# Altium project PCB_Project1.PrjPCB (part 1 of 2)
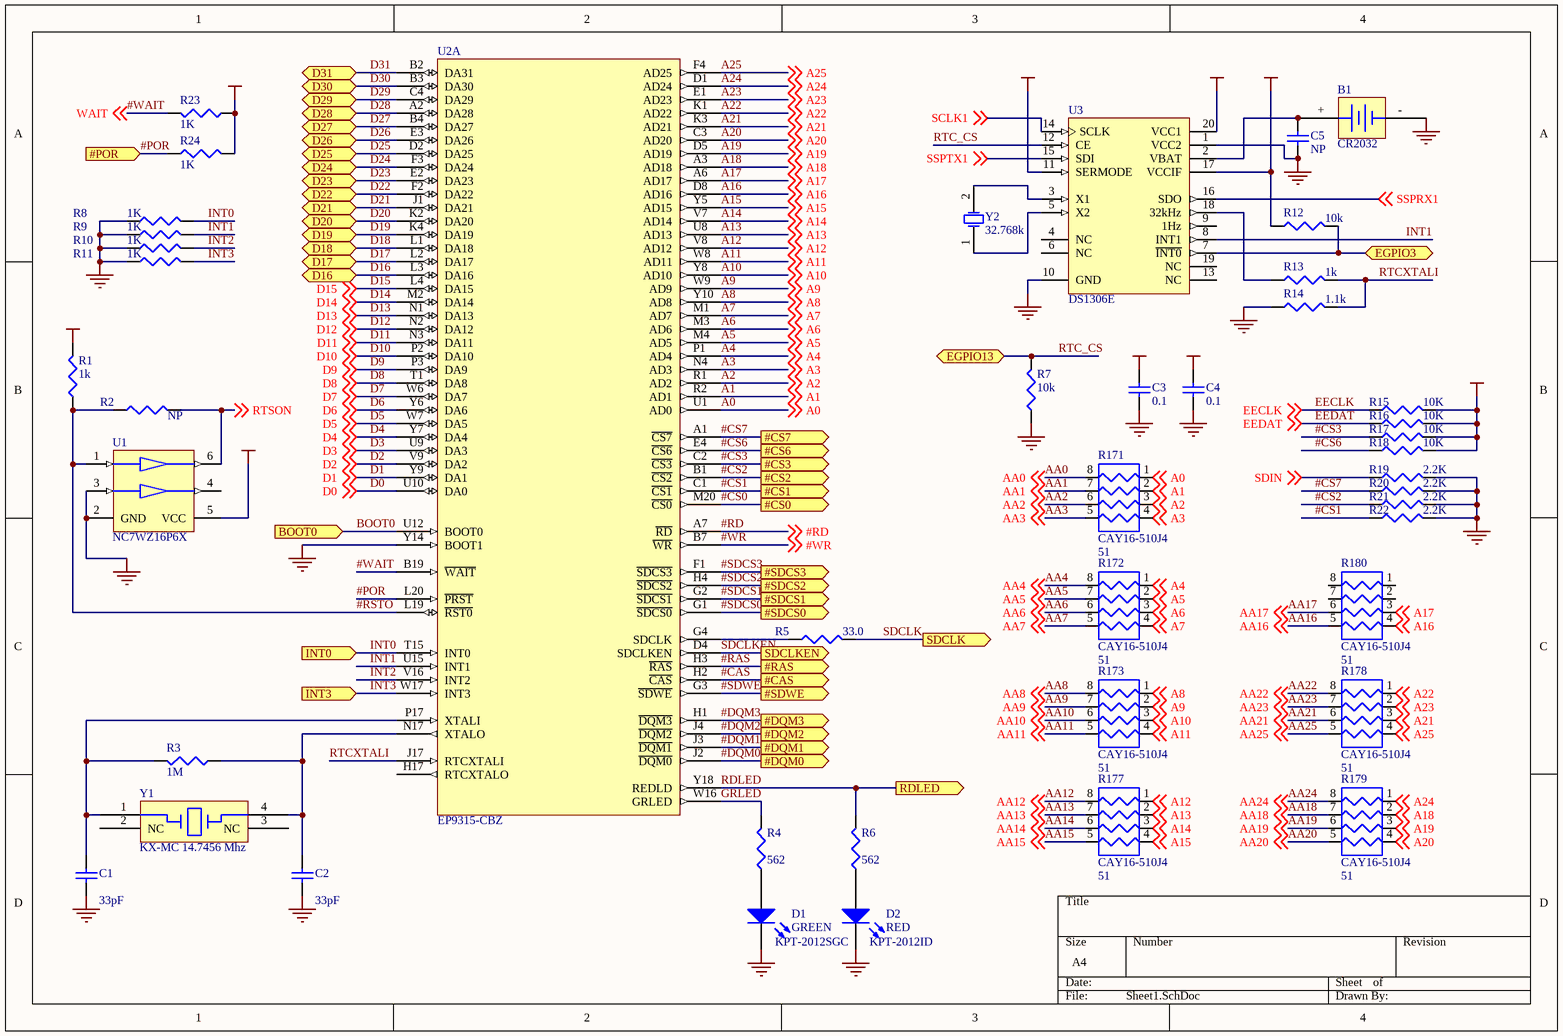
[diagram p0: Sheet1.SchDoc]
11 sheets, 503 parts. Net scope: flat (ports and power ports of the same name join across sheets).
Board file: PCB1.PcbDoc
Sheets:
  Sheet1.SchDoc
  Sheet2.SchDoc
  Sheet3.SchDoc
  Sheet4.SchDoc
  Sheet5.SchDoc
  Sheet6.SchDoc
  Sheet7.SchDoc
  Sheet8.SchDoc
  Sheet9.SchDoc
  Sheet10.SchDoc
  Sheet11.SchDoc

## Sheet Sheet1.SchDoc: RTC
size A4; SheetNumber: 1; SheetTotal: 9

### Parts
B1  CR2032  [CR2032]
C1  33pF  [0603]
C2  33pF  [0603]
C3  0.1  [0603]
C4  0.1  [0603]
C5  NP  [0603]
D1  GREEN  value KPT-2012SGC  [DSO-F2/D6.1]
D2  RED  value KPT-2012ID  [DSO-F2/D6.1]
R1  1k  [CR1608-0603]
R2  NP  [CR1608-0603]
R3  1M  [CR1608-0603]
R4  562  [CR1608-0603]
R5  value 33.0  [CR1608-0603]  (hidden comment: 33)
R6  562  [CR1608-0603]
R7  10k  [CR1608-0603]
R8  1k  [CR1608-0603]
R9  1k  [CR1608-0603]
R10  1k  [CR1608-0603]
R11  1k  [CR1608-0603]
R12  10k  [CR1608-0603]
R13  1k  [CR1608-0603]
R14  1.1k  [CR1608-0603]
R15  10k  [CR1608-0603]
R16  10k  [CR1608-0603]
R17  10k  [CR1608-0603]
R18  10k  [CR1608-0603]
R19  2.2k  [CR1608-0603]
R20  2.2k  [CR1608-0603]
R21  2.2k  [CR1608-0603]
R22  2.2k  [CR1608-0603]
R23  1k  [CR1608-0603]
R24  1k  [CR1608-0603]
R171  CAY16-510J4  value 51  [CAY16-J4]
R172  CAY16-510J4  value 51  [CAY16-J4]
R173  CAY16-510J4  value 51  [CAY16-J4]
R177  CAY16-510J4  value 51  [CAY16-J4]
R178  CAY16-510J4  value 51  [CAY16-J4]
R179  CAY16-510J4  value 51  [CAY16-J4]
R180  CAY16-510J4  value 51  [CAY16-J4]
U1  NC7WZ16P6X  [SC88]
U2  EP9315-CBZ  [BGA352x20]  (part A of 4)
U3  DS1306E  [TSSOP20]
Y1  KX-MC 14.7456 Mhz  [KX-MC]
Y2  32.768k  [BCY-W2/D3.1]

### Ports
#CAS (out), #CS0 (out), #CS1 (out), #CS2 (out), #CS3 (out), #CS6 (out), #CS7 (out), #DQM0 (out), #DQM1 (out), #DQM2 (out), #DQM3 (out), #POR (in), #RAS (out), #SDCS0 (out), #SDCS1 (out), #SDCS2 (out), #SDCS3 (out), #SDWE (out), BOOT0 (in), D16 (bidir), D17 (bidir), D18 (bidir), D19 (bidir), D20 (bidir), D21 (bidir), D22 (bidir), D23 (bidir), D24 (bidir), D25 (bidir), D26 (bidir), D27 (bidir), D28 (bidir), D29 (bidir), D30 (bidir), D31 (bidir), EGPIO3 (bidir), EGPIO13 (bidir), INT0 (in), INT3 (in), RDLED (out), SDCLK (out), SDCLKEN (out)

### Nets
GND: B1.- C1.1 C2.1 C3.1 C4.1 C5.1 D1.2(K) D2.2(K) R7.1 R8.1 R9.1 R10.1 R11.1 R14.1 R19.2 R20.2 R21.2 R22.2 U1.2(GND) U1.3(B) U2.Y14(BOOT1) U3.1(VCC2) U3.10(GND)
VCC5V0: C4.2 U3.20(VCC1)
VCCIO: C3.2 R1.2 R12.1 R15.2 R16.2 R17.2 R18.2 R23.1 R24.2 U1.5(VCC) U3.11(SERMODE) U3.17(VCCIF)
#CAS: U2.H2(~{CAS}) ; port #CAS
#CS0: U2.M20(~{CS0}) ; port #CS0
#CS1: R22.1 U2.C1(~{CS1}) ; port #CS1
#CS2: R21.1 U2.B1(~{CS2}) ; port #CS2
#CS3: R17.1 U2.C2(~{CS3}) ; port #CS3
#CS6: R18.1 U2.E4(~{CS6}) ; port #CS6
#CS7: R20.1 U2.A1(~{CS7}) ; port #CS7
#DQM0: U2.J2(~{DQM0}) ; port #DQM0
#DQM1: U2.J3(~{DQM1}) ; port #DQM1
#DQM2: U2.J4(~{DQM2}) ; port #DQM2
#DQM3: U2.H1(~{DQM3}) ; port #DQM3
#POR: R24.1 U2.L20(~{PRST}) ; port #POR
#RAS: U2.H3(~{RAS}) ; port #RAS
#RD: U2.A7(~{RD}) ; off-sheet #RD
#RSTO: R1.1 R2.1 U1.1(A) U2.L19(~{RST0})
#SDCS0: U2.G1(~{SDCS0}) ; port #SDCS0
#SDCS1: U2.G2(~{SDCS1}) ; port #SDCS1
#SDCS2: U2.H4(~{SDCS2}) ; port #SDCS2
#SDCS3: U2.F1(~{SDCS3}) ; port #SDCS3
#SDWE: U2.G3(~{SDWE}) ; port #SDWE
#WAIT: R23.2 U2.B19(~{WAIT}) ; off-sheet WAIT  [also labelled WAIT]
#WR: U2.B7(~{WR}) ; off-sheet #WR
A0: R171.1 U2.U1(AD0) ; off-sheet A0
A1: R171.2 U2.R2(AD1) ; off-sheet A1
A2: R171.3 U2.R1(AD2) ; off-sheet A2
A3: R171.4 U2.N4(AD3) ; off-sheet A3
A4: R172.1 U2.P1(AD4) ; off-sheet A4
A5: R172.2 U2.M4(AD5) ; off-sheet A5
A6: R172.3 U2.M3(AD6) ; off-sheet A6
A7: R172.4 U2.M1(AD7) ; off-sheet A7
A8: R173.1 U2.Y10(AD8) ; off-sheet A8
A9: R173.2 U2.W9(AD9) ; off-sheet A9
A10: R173.3 U2.Y8(AD10) ; off-sheet A10
A11: R173.4 U2.W8(AD11) ; off-sheet A11
A12: R177.1 U2.V8(AD12) ; off-sheet A12
A13: R177.2 U2.U8(AD13) ; off-sheet A13
A14: R177.3 U2.V7(AD14) ; off-sheet A14
A15: R177.4 U2.Y5(AD15) ; off-sheet A15
A16: R180.4 U2.D8(AD16) ; off-sheet A16
A17: R180.3 U2.A6(AD17) ; off-sheet A17
A18: R179.2 U2.A3(AD18) ; off-sheet A18
A19: R179.3 U2.D5(AD19) ; off-sheet A19
A20: R179.4 U2.C3(AD20) ; off-sheet A20
A21: R178.3 U2.K3(AD21) ; off-sheet A21
A22: R178.1 U2.K1(AD22) ; off-sheet A22
A23: R178.2 U2.E1(AD23) ; off-sheet A23
A24: R179.1 U2.D1(AD24) ; off-sheet A24
A25: R178.4 U2.F4(AD25) ; off-sheet A25
AA0: R171.8 ; off-sheet AA0
AA1: R171.7 ; off-sheet AA1
AA2: R171.6 ; off-sheet AA2
AA3: R171.5 ; off-sheet AA3
AA4: R172.8 ; off-sheet AA4
AA5: R172.7 ; off-sheet AA5
AA6: R172.6 ; off-sheet AA6
AA7: R172.5 ; off-sheet AA7
AA8: R173.8 ; off-sheet AA8
AA9: R173.7 ; off-sheet AA9
AA10: R173.6 ; off-sheet AA10
AA11: R173.5 ; off-sheet AA11
AA12: R177.8 ; off-sheet AA12
AA13: R177.7 ; off-sheet AA13
AA14: R177.6 ; off-sheet AA14
AA15: R177.5 ; off-sheet AA15
AA16: R180.5 ; off-sheet AA16
AA17: R180.6 ; off-sheet AA17
AA18: R179.7 ; off-sheet AA18
AA19: R179.6 ; off-sheet AA19
AA20: R179.5 ; off-sheet AA20
AA21: R178.6 ; off-sheet AA21
AA22: R178.8 ; off-sheet AA22
AA23: R178.7 ; off-sheet AA23
AA24: R179.8 ; off-sheet AA24
AA25: R178.5 ; off-sheet AA25
BOOT0: U2.U12(BOOT0) ; port BOOT0
D0: U2.U10(DA0) ; off-sheet D0
D1: U2.Y9(DA1) ; off-sheet D1
D2: U2.V9(DA2) ; off-sheet D2
D3: U2.U9(DA3) ; off-sheet D3
D4: U2.Y7(DA4) ; off-sheet D4
D5: U2.W7(DA5) ; off-sheet D5
D6: U2.Y6(DA6) ; off-sheet D6
D7: U2.W6(DA7) ; off-sheet D7
D8: U2.T1(DA8) ; off-sheet D8
D9: U2.P3(DA9) ; off-sheet D9
D10: U2.P2(DA10) ; off-sheet D10
D11: U2.N3(DA11) ; off-sheet D11
D12: U2.N2(DA12) ; off-sheet D12
D13: U2.N1(DA13) ; off-sheet D13
D14: U2.M2(DA14) ; off-sheet D14
D15: U2.L4(DA15) ; off-sheet D15
D16: U2.L3(DA16) ; port D16
D17: U2.L2(DA17) ; port D17
D18: U2.L1(DA18) ; port D18
D19: U2.K4(DA19) ; port D19
D20: U2.K2(DA20) ; port D20
D21: U2.J1(DA21) ; port D21
D22: U2.F2(DA22) ; port D22
D23: U2.E2(DA23) ; port D23
D24: U2.F3(DA24) ; port D24
D25: U2.D2(DA25) ; port D25
D26: U2.E3(DA26) ; port D26
D27: U2.B4(DA27) ; port D27
D28: U2.A2(DA28) ; port D28
D29: U2.C4(DA29) ; port D29
D30: U2.B3(DA30) ; port D30
D31: U2.B2(DA31) ; port D31
EECLK: R15.1 ; off-sheet EECLK
EEDAT: R16.1 ; off-sheet EEDAT
GRLED: R4.2 U2.W16(GRLED)
INT0: R8.2 U2.T15(INT0) ; port INT0
INT1: R9.2 U2.U15(INT1) U3.8(INT1)
INT2: R10.2 U2.V16(INT2)
INT3: R11.2 U2.W17(INT3) ; port INT3
RDLED: R6.2 U2.Y18(REDLD) ; port RDLED
RTC_CS: R7.2 U3.12(CE) ; port EGPIO13
RTCXTALI: R13.2 R14.2 U2.J17(RTCXTALI)
RTSON: R2.2 U1.6(Y) ; off-sheet RTSON
SCLK1: U3.14(SCLK) ; off-sheet SCLK1
SDCLK: R5.2 ; port SDCLK
SDCLKEN: U2.D4(SDCLKEN) ; port SDCLKEN
SDIN: R19.1 ; off-sheet SDIN
SSPRX1: U3.16(SDO) ; off-sheet SSPRX1  [project net SD_DO]
SSPTX1: U3.15(SDI) ; off-sheet SSPTX1  [project net SD_DI]
NetB1_+: B1.+ C5.2 U3.2(VBAT)
NetC1_2: C1.2 R3.2 U2.P17(XTALI) Y1.1
NetC2_2: C2.2 R3.1 U2.N17(XTALO) Y1.4
NetD1_1: D1.1(A) R4.1
NetD2_1: D2.1(A) R6.1
NetR5_1: R5.1 U2.G4(SDCLK)
NetR12_2: R12.2 U3.7(~{INT0}) ; port EGPIO3
NetR13_1: R13.1 U3.18(32kHz)
NetU3_3: U3.3(X1) Y2.2(OSC2)
NetU3_5: U3.5(X2) Y2.1(OSC1)

Not connected (* = marked no-connect by the designer): R180 1 2 7 8; U1 4(Y); U2 H17(RTCXTALO); U3 4(NC) 6(NC) 9(1Hz) 13(NC) 19(NC); Y1 2(NC) 3(NC)

### Library data of the parts
B1 = CR2032: CR2032 Battery holder
C1-C4 = C0603: Ceramic Chip Capacitor - Standard; Note: Footprint corresponds to dimensions for bulk cassette packaging. This case size has tightened tolerances.; Published: 17-Jul-2002; LatestRevisionDate: 19-Mar-2004; LatestRevisionNote: Silkscreen size reduced.; DatasheetDocument: Mar-2001; PackageDocument: Mar-2001; PackageReference: 0603; Publisher: Altium Limited; Code_JEITA: 0603; Code_IPC: 1608 [0603]; ComponentLink1Description: Manufacturer Link; ComponentLink1URL: http://www.kemet.com/; ComponentLink2Description: Datasheet; ComponentLink2URL: http://www.kemet.com/kemet/web/homepage/kechome.nsf/vapubfilesname/F3102TA.pdf/$file/F3102TA.pdf
  C1 C2: Value: 33pF
  C3 C4: Value: 0.1
C5 = C0603: Ceramic Chip Capacitor - Standard; Note: Footprint corresponds to dimensions for bulk cassette packaging. This case size has tightened tolerances.; Value: 0.1; Published: 17-Jul-2002; LatestRevisionDate: 19-Mar-2004; LatestRevisionNote: Silkscreen size reduced.; DatasheetDocument: Mar-2001; PackageDocument: Mar-2001; PackageReference: 0603; Publisher: Altium Limited; Code_JEITA: 0603; Code_IPC: 1608 [0603]; ComponentLink1Description: Manufacturer Link; ComponentLink1URL: http://www.kemet.com/; ComponentLink2Description: Datasheet; ComponentLink2URL: http://www.kemet.com/kemet/web/homepage/kechome.nsf/vapubfilesname/F3102TA.pdf/$file/F3102TA.pdf
D1 D2 = LED2: Typical RED, GREEN, YELLOW, AMBER GaAs LED; Published: 8-Jun-2000; Revision: July-2002: Re-released for DXP Platform.; Publisher: Altium Limited
R1-R24 = Res3: Resistor; Published: 8-Jun-2000; Revision: July-2002: Re-released for DXP Platform.; Publisher: Altium Limited
  R1 R13: Value: 1k
  R2: Value: NP
  R3: Value: 1M
  R4 R6: Value: 562
  R7 R12: Value: 10k
  R8-R11 R23 R24: Value: 1K
  R14: Value: 1.1k
  R15-R18: Value: 10K
  R19-R22: Value: 2.2K
R171-R173 R177-R180 = CAY16-J4: Chip Resistor Arrays
U1 = NC7WZ16P6X: TinyLogic UHS Dual Buffer
U2 = EP9315-CBZ: 32 Bit ARM920T Microcontroller with inegrated graphics, IDE, PCMCIA, Ethernet
U3 = DS1306E: Serial Alarm Real-Time Clock
Y1 = QRZ_KX_MC: QUARTZ CRYSTAL
Y2 = ECS-110-S-5P: Crystal Oscillator; Published: 17-Jul-2002; Datasheet: Latest Revision: 18-Apr-2000; Package Reference: CSM-7; Publisher: Altium Limited

## Sheet Sheet2.SchDoc
size A4
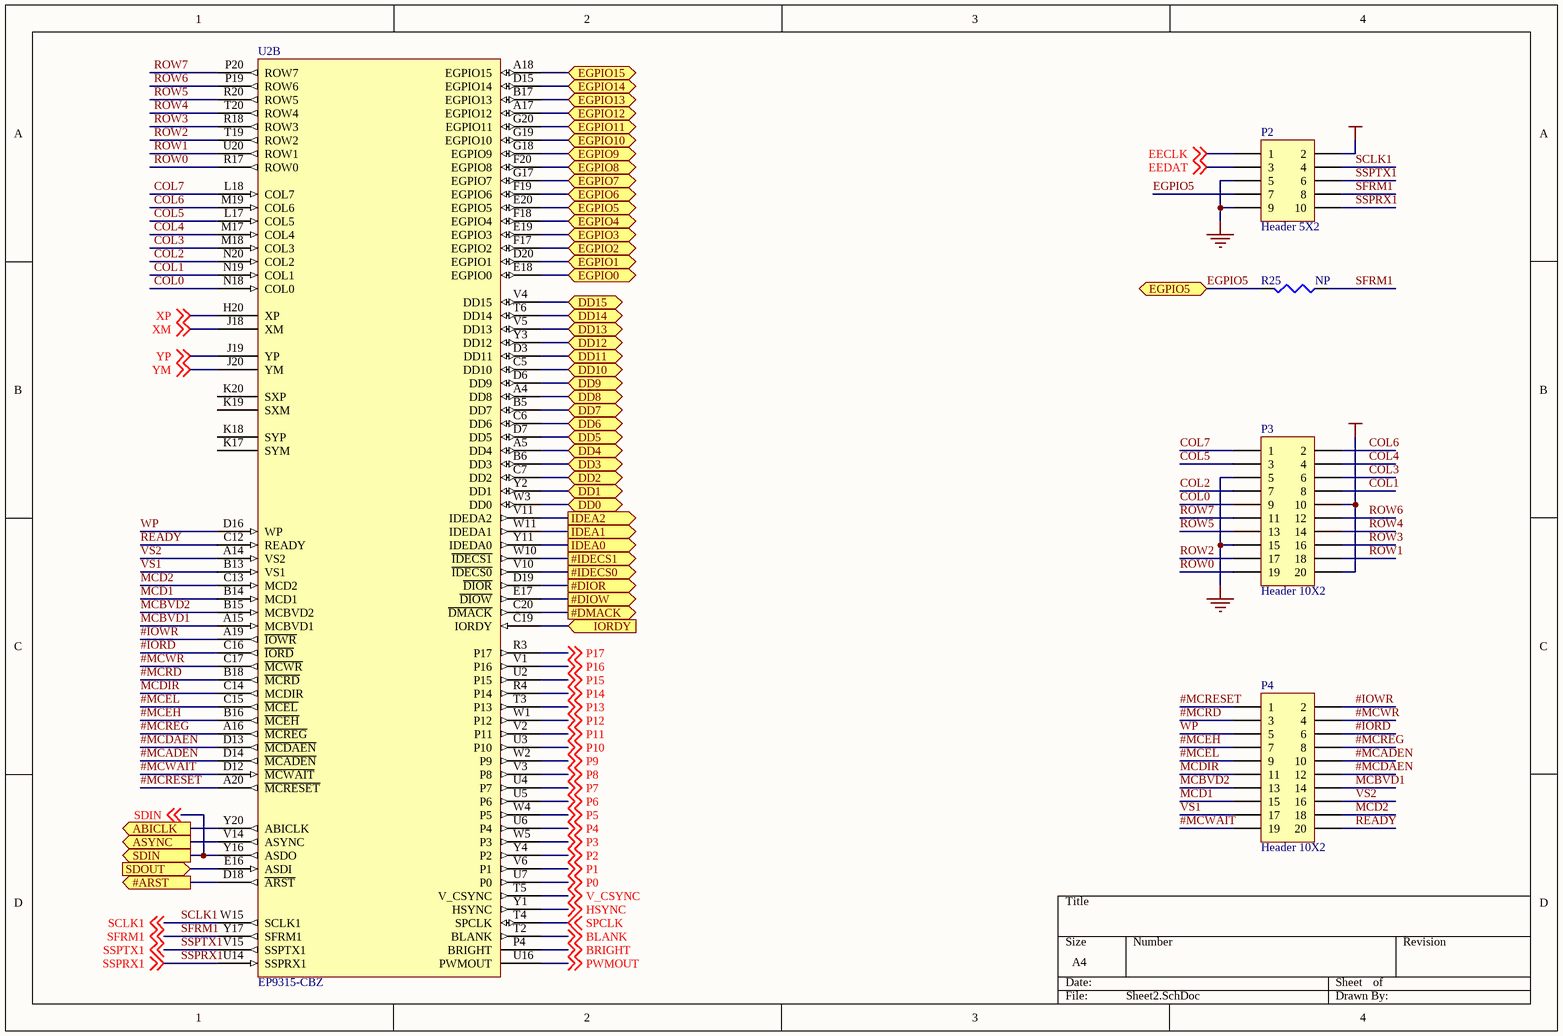
[diagram p1: Sheet2.SchDoc]

### Parts
P2  Header 5X2  [HDR2X5]
P3  Header 10X2  [HDR2X10]
P4  Header 10X2  [HDR2X10]
R25  NP  [CR1608-0603]
U2  EP9315-CBZ  [BGA352x20]  (part B of 4)

### Ports
#ARST (out), #DIOR (out), #DIOW (out), #DMACK (out), #IDECS0 (out), #IDECS1 (out), ABICLK (out), ASYNC (out), DD0 (bidir), DD1 (bidir), DD2 (bidir), DD3 (bidir), DD4 (bidir), DD5 (bidir), DD6 (bidir), DD7 (bidir), DD8 (bidir), DD9 (bidir), DD10 (bidir), DD11 (bidir), DD12 (bidir), DD13 (bidir), DD14 (bidir), DD15 (bidir), EGPIO0 (bidir), EGPIO1 (bidir), EGPIO2 (bidir), EGPIO3 (bidir), EGPIO4 (bidir), EGPIO5 (bidir), EGPIO6 (bidir), EGPIO7 (bidir), EGPIO8 (bidir), EGPIO9 (bidir), EGPIO10 (bidir), EGPIO11 (bidir), EGPIO12 (bidir), EGPIO13 (bidir), EGPIO14 (bidir), EGPIO15 (bidir), IDEA0 (out), IDEA1 (out), IDEA2 (out), IORDY (in), SDIN (out), SDOUT (in)

### Nets
GND: P2.5 P2.9 P3.5 P3.15
VCCIO: P2.2 P3.10 P3.20
#IORD: P4.6 U2.C16(~{IORD})
#IOWR: P4.2 U2.A19(~{IOWR})
#MCADEN: P4.10 U2.D14(~{MCADEN})
#MCDAEN: P4.12 U2.D13(~{MCDAEN})
#MCEH: P4.7 U2.B16(~{MCEH})
#MCEL: P4.9 U2.C15(~{MCEL})
#MCRD: P4.3 U2.B18(~{MCRD})
#MCREG: P4.8 U2.A16(~{MCREG})
#MCRESET: P4.1 U2.A20(~{MCRESET})
#MCWAIT: P4.19 U2.D12(~{MCWAIT})
#MCWR: P4.4 U2.C17(~{MCWR})
BLANK: U2.T2(BLANK) ; off-sheet BLANK
BRIGHT: U2.P4(BRIGHT) ; off-sheet BRIGHT
COL0: P3.9 U2.N18(COL0)
COL1: P3.8 U2.N19(COL1)
COL2: P3.7 U2.N20(COL2)
COL3: P3.6 U2.M18(COL3)
COL4: P3.4 U2.M17(COL4)
COL5: P3.3 U2.L17(COL5)
COL6: P3.2 U2.M19(COL6)
COL7: P3.1 U2.L18(COL7)
EECLK: P2.1 ; off-sheet EECLK
EEDAT: P2.3 ; off-sheet EEDAT
EGPIO0: U2.E18(EGPIO0) ; port EGPIO0
EGPIO5: P2.7 R25.2 U2.E20(EGPIO5) ; port EGPIO5
HSYNC: U2.Y1(HSYNC) ; off-sheet HSYNC
MCBVD1: P4.14 U2.A15(MCBVD1)
MCBVD2: P4.13 U2.B15(MCBVD2)
MCD1: P4.15 U2.B14(MCD1)
MCD2: P4.18 U2.C13(MCD2)
MCDIR: P4.11 U2.C14(MCDIR)
P0: U2.U7(P0) ; off-sheet P0
P1: U2.V6(P1) ; off-sheet P1
P2: U2.Y4(P2) ; off-sheet P2
P3: U2.W5(P3) ; off-sheet P3
P4: U2.U6(P4) ; off-sheet P4
P5: U2.W4(P5) ; off-sheet P5
P6: U2.U5(P6) ; off-sheet P6
P7: U2.U4(P7) ; off-sheet P7
P8: U2.V3(P8) ; off-sheet P8
P9: U2.W2(P9) ; off-sheet P9
P10: U2.U3(P10) ; off-sheet P10
P11: U2.V2(P11) ; off-sheet P11
P12: U2.W1(P12) ; off-sheet P12
P13: U2.T3(P13) ; off-sheet P13
P14: U2.R4(P14) ; off-sheet P14
P15: U2.U2(P15) ; off-sheet P15
P16: U2.V1(P16) ; off-sheet P16
P17: U2.R3(P17) ; off-sheet P17
PWMOUT: U2.U16(PWMOUT) ; off-sheet PWMOUT
READY: P4.20 U2.C12(READY)
ROW0: P3.19 U2.R17(ROW0)
ROW1: P3.18 U2.U20(ROW1)
ROW2: P3.17 U2.T19(ROW2)
ROW3: P3.16 U2.R18(ROW3)
ROW4: P3.14 U2.T20(ROW4)
ROW5: P3.13 U2.R20(ROW5)
ROW6: P3.12 U2.P19(ROW6)
ROW7: P3.11 U2.P20(ROW7)
RTC_CS: U2.B17(EGPIO13) ; port EGPIO13
~{SD_CS}: U2.F18(EGPIO4) ; port EGPIO4
SCLK1: P2.4 U2.W15(SCLK1) ; off-sheet SCLK1
SDIN: U2.Y16(ASDO) ; off-sheet SDIN, port SDIN
SFRM1: P2.8 R25.1 U2.Y17(SFRM1) ; off-sheet SFRM1
SPCLK: U2.T4(SPCLK) ; off-sheet SPCLK
SSPRX1: P2.10 U2.U14(SSPRX1) ; off-sheet SSPRX1  [project net SD_DO]
SSPTX1: P2.6 U2.V15(SSPTX1) ; off-sheet SSPTX1  [project net SD_DI]
V_CSYNC: U2.T5(V_CSYNC) ; off-sheet V_CSYNC
VS1: P4.17 U2.B13(VS1)
VS2: P4.16 U2.A14(VS2)
WP: P4.5 U2.D16(WP)
XM: U2.J18(XM) ; off-sheet XM
XP: U2.H20(XP) ; off-sheet XP
YM: U2.J20(YM) ; off-sheet YM
YP: U2.J19(YP) ; off-sheet YP
NetR12_2: U2.E19(EGPIO3) ; port EGPIO3
NetR28_2: U2.D20(EGPIO1) ; port EGPIO1
NetR66_1: U2.F17(EGPIO2) ; port EGPIO2
NetR67_1: U2.E17(~{DIOW}) ; port #DIOW
NetR68_1: U2.D19(~{DIOR}) ; port #DIOR
NetR69_1: U2.C19(IORDY) ; port IORDY
NetR70_1: U2.C20(~{DMACK}) ; port #DMACK
NetR72_1: U2.A18(EGPIO15) ; port EGPIO15
NetR74_1: U2.B5(DD7) ; port DD7
NetR74_2: U2.C6(DD6) ; port DD6
NetR74_3: U2.D7(DD5) ; port DD5
NetR74_4: U2.A5(DD4) ; port DD4
NetR75_1: U2.B6(DD3) ; port DD3
NetR75_2: U2.C7(DD2) ; port DD2
NetR75_3: U2.Y2(DD1) ; port DD1
NetR75_4: U2.W3(DD0) ; port DD0
NetR76_1: U2.W11(IDEDA1) ; port IDEA1
NetR76_2: U2.Y11(IDEDA0) ; port IDEA0
NetR76_3: U2.V10(~{IDECS0}) ; port #IDECS0
NetR88_5: U2.D3(DD11) ; port DD11
NetR88_6: U2.C5(DD10) ; port DD10
NetR88_7: U2.D6(DD9) ; port DD9
NetR88_8: U2.A4(DD8) ; port DD8
NetR89_5: U2.V4(DD15) ; port DD15
NetR89_6: U2.T6(DD14) ; port DD14
NetR89_7: U2.V5(DD13) ; port DD13
NetR89_8: U2.Y3(DD12) ; port DD12
NetR90_1: U2.V11(IDEDA2) ; port IDEA2
NetR90_2: U2.W10(~{IDECS1}) ; port #IDECS1
NetR91_2: U2.G18(EGPIO9) ; port EGPIO9
NetR92_2: U2.F20(EGPIO8) ; port EGPIO8
NetR102_2: U2.D15(EGPIO14) ; port EGPIO14
NetR103_2: U2.E16(ASDI) ; port SDOUT
NetR106_1: U2.F19(EGPIO6) ; port EGPIO6
NetR153_1: U2.G17(EGPIO7) ; port EGPIO7
NetR156_1: U2.A17(EGPIO12) ; port EGPIO12
NetU2_D18: U2.D18(~{ARST}) ; port #ARST
NetU2_G19: U2.G19(EGPIO10) ; port EGPIO10
NetU2_G20: U2.G20(EGPIO11) ; port EGPIO11
NetU2_V14: U2.V14(ASYNC) ; port ASYNC
NetU2_Y20: U2.Y20(ABICLK) ; port ABICLK

Not connected (* = marked no-connect by the designer): U2 K17(SYM) K18(SYP) K19(SXM) K20(SXP)

### Library data of the parts
P2 = Header 5X2: Header, 5-Pin, Dual row; LatestRevisionDate: 17-Jul-2002; LatestRevisionNote: Re-released for DXP Platform.; Publisher: Altium Limited
P3 P4 = Header 10X2: Header, 10-Pin, Dual row; LatestRevisionDate: 17-Jul-2002; LatestRevisionNote: Re-released for DXP Platform.; Publisher: Altium Limited
R25 = Res3: Resistor; Published: 8-Jun-2000; Revision: July-2002: Re-released for DXP Platform.; Publisher: Altium Limited; Value: NP
U2 = EP9315-CBZ: as U2 on sheet Sheet1

## Sheet Sheet3.SchDoc
size A4
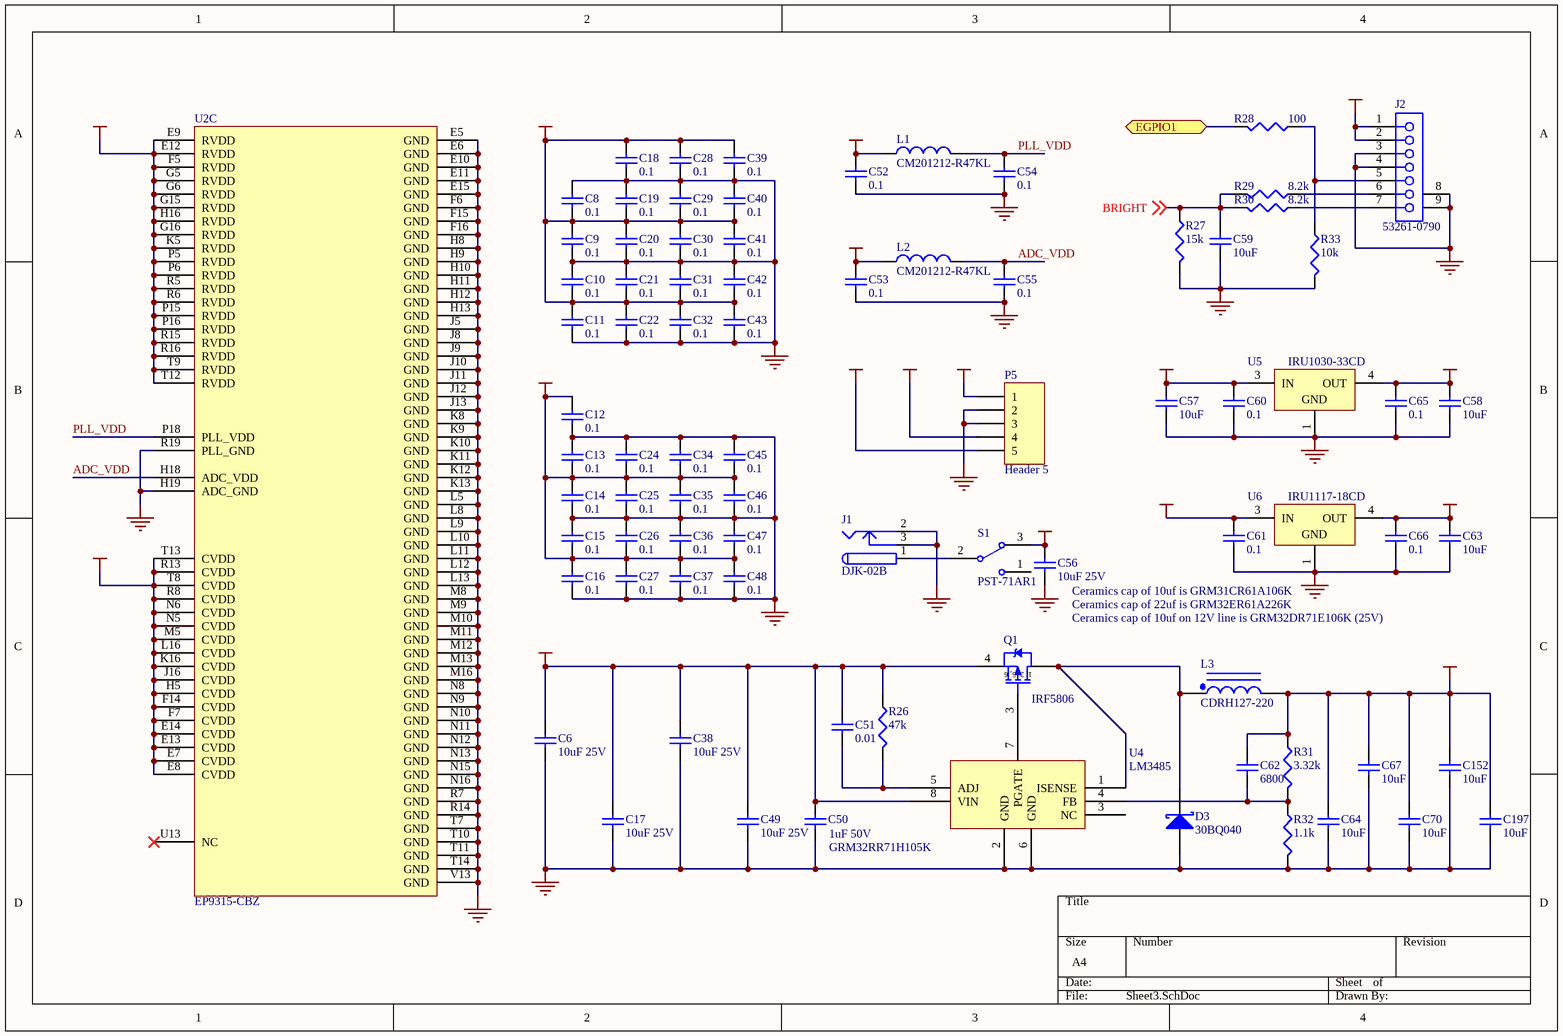
[diagram p2: Sheet3.SchDoc]

### Parts
C6  10uF 25V  [1210]
C8  0.1  [0603]
C9  0.1  [0603]
C10  0.1  [0603]
C11  0.1  [0603]
C12  0.1  [0603]
C13  0.1  [0603]
C14  0.1  [0603]
C15  0.1  [0603]
C16  0.1  [0603]
C17  10uF 25V  [1210]
C18  0.1  [0603]
C19  0.1  [0603]
C20  0.1  [0603]
C21  0.1  [0603]
C22  0.1  [0603]
C24  0.1  [0603]
C25  0.1  [0603]
C26  0.1  [0603]
C27  0.1  [0603]
C28  0.1  [0603]
C29  0.1  [0603]
C30  0.1  [0603]
C31  0.1  [0603]
C32  0.1  [0603]
C34  0.1  [0603]
C35  0.1  [0603]
C36  0.1  [0603]
C37  0.1  [0603]
C38  10uF 25V  [1210]
C39  0.1  [0603]
C40  0.1  [0603]
C41  0.1  [0603]
C42  0.1  [0603]
C43  0.1  [0603]
C45  0.1  [0603]
C46  0.1  [0603]
C47  0.1  [0603]
C48  0.1  [0603]
C49  10uF 25V  [1210]
C50  GRM32RR71H105K  value 1uF 50V  [1210]
C51  0.01  [0603]
C52  0.1  [0603]
C53  0.1  [0603]
C54  0.1  [0603]
C55  0.1  [0603]
C56  10uF 25V  [1210]
C57  10uF  [1206]
C58  10uF  [1206]
C59  10uF  [1206]
C60  0.1  [0603]
C61  0.1  [0603]
C62  6800  [0603]
C63  10uF  [1206]
C64  10uF  [1206]
C65  0.1  [0603]
C66  0.1  [0603]
C67  10uF  [1206]
C70  10uF  [1206]
C152  10uF  [1206]
C197  10uF  [1206]
D3  30BQ040  [DIODE SMC]
J1  DJK-02B  [DJK-02A]
J2  53261-0790  [53261-07]
L1  CM201212-R47KL  [INDC2012-0805]
L2  CM201212-R47KL  [INDC2012-0805]
L3  CDRH127-220  [CDRH127]
P5  Header 5  [HDR1X5]
Q1  IRF5806  [Micro6]
R26  47k  [CR1608-0603]
R27  15k  [CR1608-0603]
R28  value 100  [CR1608-0603]  (hidden comment: 0)
R29  value 8.2k  [CR1608-0603]  (hidden comment: 0)
R30  8.2k  [CR1608-0603]
R31  value 3.32k  [CR1608-0603]  (hidden comment: 3.6k)
R32  1.1k  [CR1608-0603]
R33  value 10k  [CR1608-0603]  (hidden comment: 0)
S1  PST-71AR1  [PST-71AR1]
U2  EP9315-CBZ  [BGA352x20]  (part C of 4)
U4  LM3485  [MSOP8]
U5  IRU1030-33CD  [TO-252-2 (D-PAK)]
U6  IRU1117-18CD  [TO-252-2 (D-PAK)]

### Ports
EGPIO1 (bidir)

### Nets
GND: C6.1 C8.2 C9.1 C10.2 C11.1 C12.1 C13.2 C14.1 C15.2 C16.1 C17.1 C18.1 C19.2 C20.1 C21.2 C22.1 C24.2 C25.1 C26.2 C27.1 C28.1 C29.2 C30.1 C31.2 C32.1 C34.2 C35.1 C36.2 C37.1 C38.1 C39.1 C40.2 C41.1 C42.2 C43.1 C45.2 C46.1 C47.2 C48.1 C49.1 C50.1 C52.1 C53.1 C54.1 C55.1 C56.1 C57.1 C58.1 C59.1 C60.1 C61.1 C63.1 C64.1 C65.1 C66.1 C67.1 C70.1 C152.1 C197.1 D3.1(A) J1.2 J1.3 J2.3 J2.4 J2.8 J2.9 P5.2 P5.3 R27.2 R32.2 R33.2 U2.E5(GND) U2.E6(GND) U2.E10(GND) U2.E11(GND) U2.E15(GND) U2.F6(GND) U2.F15(GND) U2.F16(GND) U2.H8(GND) U2.H9(GND) U2.H10(GND) U2.H11(GND) U2.H12(GND) U2.H13(GND) U2.H19(ADC_GND) U2.J5(GND) U2.J8(GND) U2.J9(GND) U2.J10(GND) U2.J11(GND) U2.J12(GND) U2.J13(GND) U2.K8(GND) U2.K9(GND) U2.K10(GND) U2.K11(GND) U2.K12(GND) U2.K13(GND) U2.L5(GND) U2.L8(GND) U2.L9(GND) U2.L10(GND) U2.L11(GND) U2.L12(GND) U2.L13(GND) U2.M8(GND) U2.M9(GND) U2.M10(GND) U2.M11(GND) U2.M12(GND) U2.M13(GND) U2.M16(GND) U2.N8(GND) U2.N9(GND) U2.N10(GND) U2.N11(GND) U2.N12(GND) U2.N13(GND) U2.N15(GND) U2.N16(GND) U2.R7(GND) U2.R14(GND) U2.R19(PLL_GND) U2.T7(GND) U2.T10(GND) U2.T11(GND) U2.T14(GND) U2.V13(GND) U4.2(GND) U4.6(GND) U5.1(GND) U6.1(GND)
VCC5V0: C57.2 C60.2 C62.2 C64.2 C67.2 C70.2 C152.2 C197.2 L3.2 P5.4 R31.1 U5.3(IN)
VCC12: C6.2 C17.2 C38.2 C49.2 C50.2 C51.2 C56.2 J2.1 J2.2 P5.1 Q1.4(S) R26.1 S1.3 U4.8(VIN)
VCCCORE: C12.2 C13.1 C14.2 C15.1 C16.2 C24.1 C25.2 C26.1 C27.2 C34.1 C35.2 C36.1 C37.2 C45.1 C46.2 C47.1 C48.2 C52.2 C63.2 C66.2 L1.1 U2.E7(CVDD) U2.E8(CVDD) U2.E13(CVDD) U2.E14(CVDD) U2.F7(CVDD) U2.F14(CVDD) U2.H5(CVDD) U2.J16(CVDD) U2.K16(CVDD) U2.L16(CVDD) U2.M5(CVDD) U2.N5(CVDD) U2.N6(CVDD) U2.R8(CVDD) U2.R13(CVDD) U2.T8(CVDD) U2.T13(CVDD) U6.4(OUT)
VCCIO: C8.1 C9.2 C10.1 C11.2 C18.2 C19.1 C20.2 C21.1 C22.2 C28.2 C29.1 C30.2 C31.1 C32.2 C39.2 C40.1 C41.2 C42.1 C43.2 C53.2 C58.2 C61.2 C65.2 L2.1 P5.5 U2.E9(RVDD) U2.E12(RVDD) U2.F5(RVDD) U2.G5(RVDD) U2.G6(RVDD) U2.G15(RVDD) U2.G16(RVDD) U2.H16(RVDD) U2.K5(RVDD) U2.P5(RVDD) U2.P6(RVDD) U2.P15(RVDD) U2.P16(RVDD) U2.R5(RVDD) U2.R6(RVDD) U2.R15(RVDD) U2.R16(RVDD) U2.T9(RVDD) U2.T12(RVDD) U5.4(OUT) U6.3(IN)
ADC_VDD: C55.2 L2.2 U2.H18(ADC_VDD)
BRIGHT: C59.2 R27.1 R29.2 R30.2 ; off-sheet BRIGHT
PLL_VDD: C54.2 L1.2 U2.P18(PLL_VDD)
NetC51_1: C51.1 R26.2 U4.5(ADJ)
NetC62_1: C62.1 R31.2 R32.1 U4.4(FB)
NetD3_2: D3.2(K) L3.1 Q1.1(D) Q1.2(D) Q1.5(D) Q1.6(D) U4.1(ISENSE)
NetJ1_1: J1.1 S1.2
NetJ2_5: J2.5 R28.1 R33.1
NetJ2_6: J2.6 R29.1
NetJ2_7: J2.7 R30.1
NetQ1_3: Q1.3(G) U4.7(PGATE)
NetR28_2: R28.2 ; port EGPIO1

Not connected (* = marked no-connect by the designer): S1 1; U2 U13(NC)*; U4 3(NC)

### Notes on the sheet
- Ceramics cap of 10uf is GRM31CR61A106K
- Ceramics cap of 10uf on 12V line is GRM32DR71E106K (25V)
- Ceramics cap of 22uf is GRM32ER61A226K
- (in symbol IRF5806) 1, 2, 5, 6

### Library data of the parts
C6 C17 C38 C49 C50 C56 = C1210: Ceramic Chip Capacitor - Standard; Published: 17-Jul-2002; LatestRevisionDate: 19-Mar-2004; LatestRevisionNote: Silkscreen size reduced.; DatasheetDocument: Mar-2001; PackageDocument: Mar-2001; PackageReference: 1210; Publisher: Altium Limited; Code_JEITA: 1210; Code_IPC: 3225 [1210]; ComponentLink1Description: Manufacturer Link; ComponentLink1URL: http://www.kemet.com/; ComponentLink2Description: Datasheet; ComponentLink2URL: http://www.kemet.com/kemet/web/homepage/kechome.nsf/vapubfilesname/F3102TA.pdf/$file/F3102TA.pdf
  C6 C17 C38 C49 C56: Value: 10uF
C8-C16 C18-C22 C24-C32 C34-C37 C39-C43 C45-C48 C52-C55 C60-C62 C65 C66 = C0603: as C1 on sheet Sheet1; Published: 17-Jul-2002; LatestRevisionDate: 19-Mar-2004; LatestRevisionNote: Silkscreen size reduced.; DatasheetDocument: Mar-2001; PackageDocument: Mar-2001; PackageReference: 0603; Publisher: Altium Limited; Code_JEITA: 0603; Code_IPC: 1608 [0603]; ComponentLink1Description: Manufacturer Link; ComponentLink1URL: http://www.kemet.com/; ComponentLink2Description: Datasheet; ComponentLink2URL: http://www.kemet.com/kemet/web/homepage/kechome.nsf/vapubfilesname/F3102TA.pdf/$file/F3102TA.pdf
  C8-C16 C18-C22 C24-C32 C34-C37 C39-C43 C45-C48 C52-C55 C60 C61 C65 C66: Value: 0.1
  C62: Value: 6800
C51 = C0603: as C5 on sheet Sheet1; Published: 17-Jul-2002; LatestRevisionDate: 19-Mar-2004; LatestRevisionNote: Silkscreen size reduced.; DatasheetDocument: Mar-2001; PackageDocument: Mar-2001; PackageReference: 0603; Publisher: Altium Limited; Code_JEITA: 0603; Code_IPC: 1608 [0603]; ComponentLink1Description: Manufacturer Link; ComponentLink1URL: http://www.kemet.com/; ComponentLink2Description: Datasheet; ComponentLink2URL: http://www.kemet.com/kemet/web/homepage/kechome.nsf/vapubfilesname/F3102TA.pdf/$file/F3102TA.pdf
C57-C59 C63 C64 C67 C70 C152 C197 = C1206: Ceramic Chip Capacitor - Standard; Published: 17-Jul-2002; LatestRevisionDate: 19-Mar-2004; LatestRevisionNote: Silkscreen size reduced.; DatasheetDocument: Mar-2001; PackageDocument: Mar-2001; PackageReference: 1206; Publisher: Altium Limited; Code_JEITA: 1206; Code_IPC: 3216 [1206]; ComponentLink1Description: Manufacturer Link; ComponentLink1URL: http://www.kemet.com/; ComponentLink2Description: Datasheet; ComponentLink2URL: http://www.kemet.com/kemet/web/homepage/kechome.nsf/vapubfilesname/F3102TA.pdf/$file/F3102TA.pdf; Value: 10uF
D3 = 10MQ060N: Schottky Rectifier; Package Information: Latest Revision: revH, May-2002; Published: 17-Sep-2003; Datasheet: Latest Revision: May-2002; Package Reference: SMA; Publisher: Altium Limited
J1 = DJK-02B: 2.5mm Power Plug
J2 = 53261-0790: Molex 1.25 Wire to board
L1 L2 = Inductor: Published: 8-Jun-2000; Revision: July-2002: Re-released for DXP Platform.; Publisher: Altium Limited; Value: CM201212-R47KL
L3 = CDRH127: Sumida Power Inductor
P5 = Header 5: Header, 5-Pin; LatestRevisionDate: 17-Jul-2002; LatestRevisionNote: Re-released for DXP Platform.; Publisher: Altium Limited
Q1 = IRF5806: HEXFET Power MOSFET
R26-R33 = Res3: Resistor; Published: 8-Jun-2000; Revision: July-2002: Re-released for DXP Platform.; Publisher: Altium Limited
  R26: Value: 47k
  R27: Value: 15k
  R30: Value: 8.2k
  R32: Value: 1.1k
U2 = EP9315-CBZ: as U2 on sheet Sheet1
U4 = LM3485: Hysteretic PFET Buck Controller
U5 U6 = IRU1010: 1A low dropout positive fixed regulator

## Sheet Sheet4.SchDoc
size A4
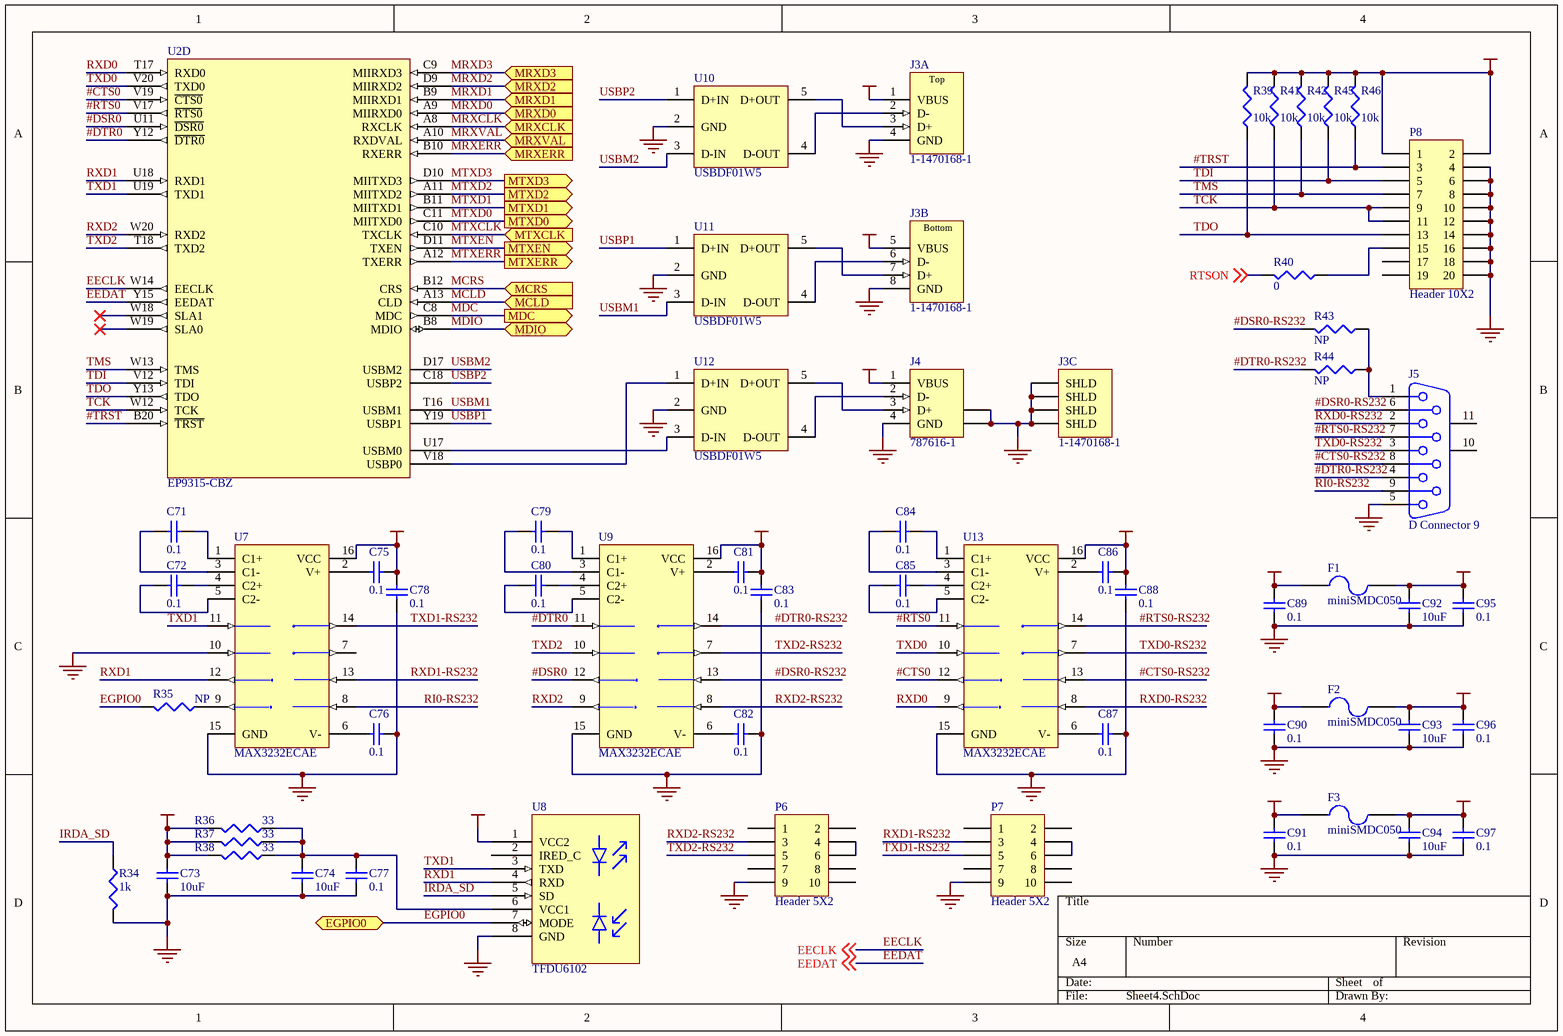
[diagram p3: Sheet4.SchDoc]

### Parts
(Parts that share a designator on the sheet are numbered #1, #2 ... from top to bottom, then left to right.)
C71  0.1  [0603]
C72  0.1  [0603]
C73  10uF  [1206]
C74  10uF  [1206]
C75  0.1  [0603]
C76  0.1  [0603]
C77  0.1  [0603]
C78  0.1  [0603]
C79  0.1  [0603]
C80  0.1  [0603]
C81  0.1  [0603]
C82  0.1  [0603]
C83  0.1  [0603]
C84  0.1  [0603]
C85  0.1  [0603]
C86  0.1  [0603]
C87  0.1  [0603]
C88  0.1  [0603]
C89  0.1  [0603]
C90  0.1  [0603]
C91  0.1  [0603]
C92  10uF  [1206]
C93  10uF  [1206]
C94  10uF  [1206]
C95  0.1  [0603]
C96  0.1  [0603]
C97  0.1  [0603]
F1  miniSMDC050  [miniSMDC050]
F2  miniSMDC050  [miniSMDC050]
F3  miniSMDC050  [miniSMDC050]
J3  1-1470168-1  [1470168]  (parts A,B,C of 3)
J4  787616-1  [787616]
J5  D Connector 9  [DSUB1.385-2H9]
P6  Header 5X2  [HDR2X5]
P7  Header 5X2  [HDR2X5]
P8  Header 10X2  [HDR2X10]
R34  1k  [CR1608-0603]
R35  NP  [CR1608-0603]
R36  33  [CR1608-0603]
R37  33  [CR1608-0603]
R38  33  [CR1608-0603]
R39  10k  [CR1608-0603]
R40  0  [CR1608-0603]
R41  10k  [CR1608-0603]
R42  10k  [CR1608-0603]
R43  NP  [CR1608-0603]
R44#1  NP  [CR1608-0603]
R45#1  10k  [CR1608-0603]
R46#1  10k  [CR1608-0603]
U2  EP9315-CBZ  [BGA352x20]  (part D of 4)
U7  MAX3232ECAE  [SSOP16]
U8  TFDU6102  [TFDU_8PIN]
U9  MAX3232ECAE  [SSOP16]
U10  USBDF01W5  [SOT353]
U11  USBDF01W5  [SOT353]
U12  USBDF01W5  [SOT353]
U13  MAX3232ECAE  [SSOP16]

### Ports
EGPIO0 (bidir), MCLD (in), MCRS (in), MDC (out), MDIO (bidir), MRXCLK (in), MRXD0 (in), MRXD1 (in), MRXD2 (in), MRXD3 (in), MRXERR (in), MRXVAL (in), MTXCLK (in), MTXD0 (out), MTXD1 (out), MTXD2 (out), MTXD3 (out), MTXEN (out), MTXERR (out)

### Nets
GND: C73.1 C74.1 C76.1 C77.1 C78.2 C82.1 C83.2 C87.1 C88.2 C89.1 C90.1 C91.1 C92.1 C93.1 C94.1 C95.1 C96.1 C97.1 J3.4(GND) J3.8(GND) J3.9(SHLD) J3.10(SHLD) J3.11(SHLD) J3.12(SHLD) J4.4(GND) J4.5(SHLD) J4.6(SHLD) J5.5 P6.9 P7.9 P8.4 P8.6 P8.8 P8.10 P8.12 P8.14 P8.16 P8.18 P8.20 R34.2 U7.10(T2IN) U7.15(GND) U8.8(GND) U9.15(GND) U10.2(GND) U11.2(GND) U12.2(GND) U13.15(GND)
PWR_USB0: C92.2 C95.2 F1.2 J3.1(VBUS)
PWR_USB1: C93.2 C96.2 F2.2 J3.5(VBUS)
PWR_USB2: C94.2 C97.2 F3.2 J4.1(VBUS)
VCC5V0: C89.2 C90.2 C91.2 F1.1 F2.1 F3.1
VCCIO: C73.2 C75.1 C78.1 C81.1 C83.1 C86.1 C88.1 P8.1 P8.2 R36.2 R37.2 R38.2 R39.2 R41.2 R42.2 R45#1.2 R46#1.2 U7.16(VCC) U8.1(VCC2) U9.16(VCC) U13.16(VCC)
#CTS0: U2.V19(~{CTS0}) U13.12(R1OUT)
#CTS0-RS232: J5.8 U13.13(R1IN)
#DSR0: U2.U11(~{DSR0}) U9.12(R1OUT)
#DSR0-RS232: J5.6 R43.2 U9.13(R1IN)
#DTR0: U2.Y12(~{DTR0}) U9.11(T1IN)
#DTR0-RS232: J5.4 R44#1.2 U9.14(T1OUT)
#RTS0: U2.V17(~{RTS0}) U13.11(T1IN)
#RTS0-RS232: J5.7 U13.14(T1OUT)
#TRST: P8.3 R46#1.1 U2.B20(~{TRST})
EECLK: U2.W14(EECLK) ; off-sheet EECLK
EEDAT: U2.Y15(EEDAT) ; off-sheet EEDAT
EGPIO0: R35.2 U8.7(MODE) ; port EGPIO0
IRDA_SD: R34.1 U8.5(SD)
MCLD: U2.A13(CLD) ; port MCLD
MCRS: U2.B12(CRS) ; port MCRS
MDC: U2.C8(MDC) ; port MDC
MDIO: U2.B8(MDIO) ; port MDIO
MRXCLK: U2.A8(RXCLK) ; port MRXCLK
MRXD0: U2.A9(MIIRXD0) ; port MRXD0
MRXD1: U2.B9(MIIRXD1) ; port MRXD1
MRXD2: U2.D9(MIIRXD2) ; port MRXD2
MRXD3: U2.C9(MIIRXD3) ; port MRXD3
MRXERR: U2.B10(RXERR) ; port MRXERR
MRXVAL: U2.A10(RXDVAL) ; port MRXVAL
MTXCLK: U2.C10(TXCLK) ; port MTXCLK
MTXD0: U2.C11(MIITXD0) ; port MTXD0
MTXD1: U2.B11(MIITXD1) ; port MTXD1
MTXD2: U2.A11(MIITXD2) ; port MTXD2
MTXD3: U2.D10(MIITXD3) ; port MTXD3
MTXEN: U2.D11(TXEN) ; port MTXEN
MTXERR: U2.A12(TXERR) ; port MTXERR
RI0-RS232: J5.9 U7.8(R2IN)
RTSON: R40.2 ; off-sheet RTSON
RXD0: U2.T17(RXD0) U13.9(R2OUT)
RXD0-RS232: J5.2 U13.8(R2IN)
RXD1: U2.U18(RXD1) U7.12(R1OUT) U8.4(RXD)
RXD1-RS232: P7.3 U7.13(R1IN)
RXD2: U2.W20(RXD2) U9.9(R2OUT)
RXD2-RS232: P6.3 U9.8(R2IN)
TCK: P8.9 P8.11 R41.1 U2.W12(TCK)
TDI: P8.5 R45#1.1 U2.V12(TDI)
TDO: P8.13 R39.1 U2.Y13(TDO)
TMS: P8.7 R42.1 U2.W13(TMS)
TXD0: U2.V20(TXD0) U13.10(T2IN)
TXD0-RS232: J5.3 U13.7(T2OUT)
TXD1: U2.U19(TXD1) U7.11(T1IN) U8.3(TXD)
TXD1-RS232: P7.5 U7.14(T1OUT)
TXD2: U2.T18(TXD2) U9.10(T2IN)
TXD2-RS232: P6.5 U9.7(T2OUT)
USBM1: U2.T16(USBM1) U11.3(D-IN)
USBM2: U2.D17(USBM2) U10.3(D-IN)
USBP1: U2.Y19(USBP1) U11.1(D+IN)
USBP2: U2.C18(USBP2) U10.1(D+IN)
NetC71_1: C71.1 U7.1(C1+)
NetC71_2: C71.2 U7.3(C1-)
NetC72_1: C72.1 U7.4(C2+)
NetC72_2: C72.2 U7.5(C2-)
NetC74_2: C74.2 C77.2 R36.1 R37.1 R38.1 U8.6(VCC1)
NetC75_2: C75.2 U7.2(V+)
NetC76_2: C76.2 U7.6(V-)
NetC79_1: C79.1 U9.1(C1+)
NetC79_2: C79.2 U9.3(C1-)
NetC80_1: C80.1 U9.4(C2+)
NetC80_2: C80.2 U9.5(C2-)
NetC81_2: C81.2 U9.2(V+)
NetC82_2: C82.2 U9.6(V-)
NetC84_1: C84.1 U13.1(C1+)
NetC84_2: C84.2 U13.3(C1-)
NetC85_1: C85.1 U13.4(C2+)
NetC85_2: C85.2 U13.5(C2-)
NetC86_2: C86.2 U13.2(V+)
NetC87_2: C87.2 U13.6(V-)
NetJ3_2: J3.2(D-) U10.4(D-OUT)
NetJ3_3: J3.3(D+) U10.5(D+OUT)
NetJ3_6: J3.6(D-) U11.4(D-OUT)
NetJ3_7: J3.7(D+) U11.5(D+OUT)
NetJ4_2: J4.2(D-) U12.4(D-OUT)
NetJ4_3: J4.3(D+) U12.5(D+OUT)
NetJ5_1: J5.1 R43.1 R44#1.1
NetP6_4: P6.4 P6.6
NetP7_4: P7.4 P7.6
NetP8_15: P8.15 R40.1
NetR35_1: R35.1 U7.9(R2OUT)
NetU2_U17: U2.U17(USBM0) U12.3(D-IN)
NetU2_V18: U2.V18(USBP0) U12.1(D+IN)

Not connected (* = marked no-connect by the designer): J5 10(MH1) 11(MH2); P6 1 2 7 8 10; P7 1 2 7 8 10; P8 17 19; U2 W18(SLA1)* W19(SLA0)*; U7 7(T2OUT); U8 2(IRED_C)

### Notes on the sheet
- (in symbol 1-1470168-1, part A) Top
- (in symbol 1-1470168-1, part B) Bottom

### Library data of the parts
C71 C72 C75-C91 C95-C97 = C0603: as C1 on sheet Sheet1; Published: 17-Jul-2002; LatestRevisionDate: 19-Mar-2004; LatestRevisionNote: Silkscreen size reduced.; DatasheetDocument: Mar-2001; PackageDocument: Mar-2001; PackageReference: 0603; Publisher: Altium Limited; Code_JEITA: 0603; Code_IPC: 1608 [0603]; ComponentLink1Description: Manufacturer Link; ComponentLink1URL: http://www.kemet.com/; ComponentLink2Description: Datasheet; ComponentLink2URL: http://www.kemet.com/kemet/web/homepage/kechome.nsf/vapubfilesname/F3102TA.pdf/$file/F3102TA.pdf; Value: 0.1
C73 C74 C92-C94 = C1206: Ceramic Chip Capacitor - Standard; Published: 17-Jul-2002; LatestRevisionDate: 19-Mar-2004; LatestRevisionNote: Silkscreen size reduced.; DatasheetDocument: Mar-2001; PackageDocument: Mar-2001; PackageReference: 1206; Publisher: Altium Limited; Code_JEITA: 1206; Code_IPC: 3216 [1206]; ComponentLink1Description: Manufacturer Link; ComponentLink1URL: http://www.kemet.com/; ComponentLink2Description: Datasheet; ComponentLink2URL: http://www.kemet.com/kemet/web/homepage/kechome.nsf/vapubfilesname/F3102TA.pdf/$file/F3102TA.pdf; Value: 10uF
F1-F3 = miniSMDC050: miniSMDC050 Fuse component
J3 = 1-1470168-1: USB 1.1, Right Angle, Thru-Hole, A Type, Receptacle, 4x4 Position, Stacked, Black; ContactMaterial: Copper Alloy; ContactPlating: Gold Flash; TerminationLength: 3.18mm [0.125in.]; PCB_Layout: Complies with manufacturer's recommendation.; DrillSize: Corresponds to nominal value.; PanelGround: With; Published: 15-Jul-2004; DatasheetDocument: 15-Aug-2002; PackageDocument: 15-Aug-2002; PackageReference: 1470168; Publisher: Altium Limited; ComponentLink1Description: Manufacturer Link; ComponentLink1URL: http://www.tycoelectronics.com/; HousingMaterial: Glass-Filled Thermoplastic
J4 = 787616-1: USB 1.1, Right Angle, Thru-Hole, A Type, Receptacle, 4 Position, Black; Note: Directive 2000/53/EC (ELV) Compliant; ContactMaterial: Copper Alloy; ContactPlating: Gold (30) over Palladium Nickel; TerminationLength: 2.84mm [0.112in.]; PCB_Layout: Complies with manufacturer's recommendation.; DrillSize: Corresponds to nominal value.; PanelGround: Without; Published: 15-Jul-2004; DatasheetDocument: 11-Jan-2004; PackageDocument: 11-Jan-2004; PackageReference: 787616; Publisher: Altium Limited; HousingMaterial: Thermoplastic
J5 = D Connector 9: Receptacle Assembly, 9 Position, Right Angle; PackageDocument: O; Positions: 9; Published: 15-Jun-2001; LatestRevisionDate: 17-Jul-2002; LatestRevisionNote: Re-released for DXP Platform.; DatasheetDocument: 1-Sep-1999; PackageReference: 788750; Publisher: Altium Limited; Orientation: Right Angle; Gender: Receptacle
P6 P7 = Header 5X2: Header, 5-Pin, Dual row; LatestRevisionDate: 17-Jul-2002; LatestRevisionNote: Re-released for DXP Platform.; Publisher: Altium Limited
P8 = Header 10X2: Header, 10-Pin, Dual row; Revision: 17-Jul-2002: Re-released for DXP Platform.; Publisher: Altium Limited
R34-R43 R44#1 R45#1 R46#1 = Res3: Resistor; Published: 8-Jun-2000; Revision: July-2002: Re-released for DXP Platform.; Publisher: Altium Limited
  R34: Value: 1k
  R35 R43 R44#1: Value: NP
  R36-R38: Value: 33
  R39 R41 R42 R45#1 R46#1: Value: 10k
  R40: Value: 0
U2 = EP9315-CBZ: as U2 on sheet Sheet1
U7 U9 U13 = MAX3232ECAE: ±15kV ESD-Protected, 3.0V to 5.5V, Low-Power, up to 250kbps, True RS-232 Transceiver; PackageDocument: 1996; Published: 16-Jan-2001; LatestRevisionDate: 6-Jun-2005; LatestRevisionNote: Stylized 3D Model Added.; DatasheetDocument: Mar-1999; PackageReference: SSOP16; Publisher: Altium Limited; ComponentLink1Description: Manufacturer Link; ComponentLink1URL: http://www.maxim-ic.com/; ComponentLink2Description: Datasheet; ComponentLink2URL: http://pdfserv.maxim-ic.com/en/ds/MAX3222E-MAX3246E.pdf
U8 = TFDU6102: Fast Infrared Transceiver Module (FIR, 4 Mbit/s)
U10-U12 = USBDF01W5: EMI FILTER AND LINE TERMINATION  FOR USB DOWNSTREAM PORTS

## Sheet Sheet5.SchDoc
size A4
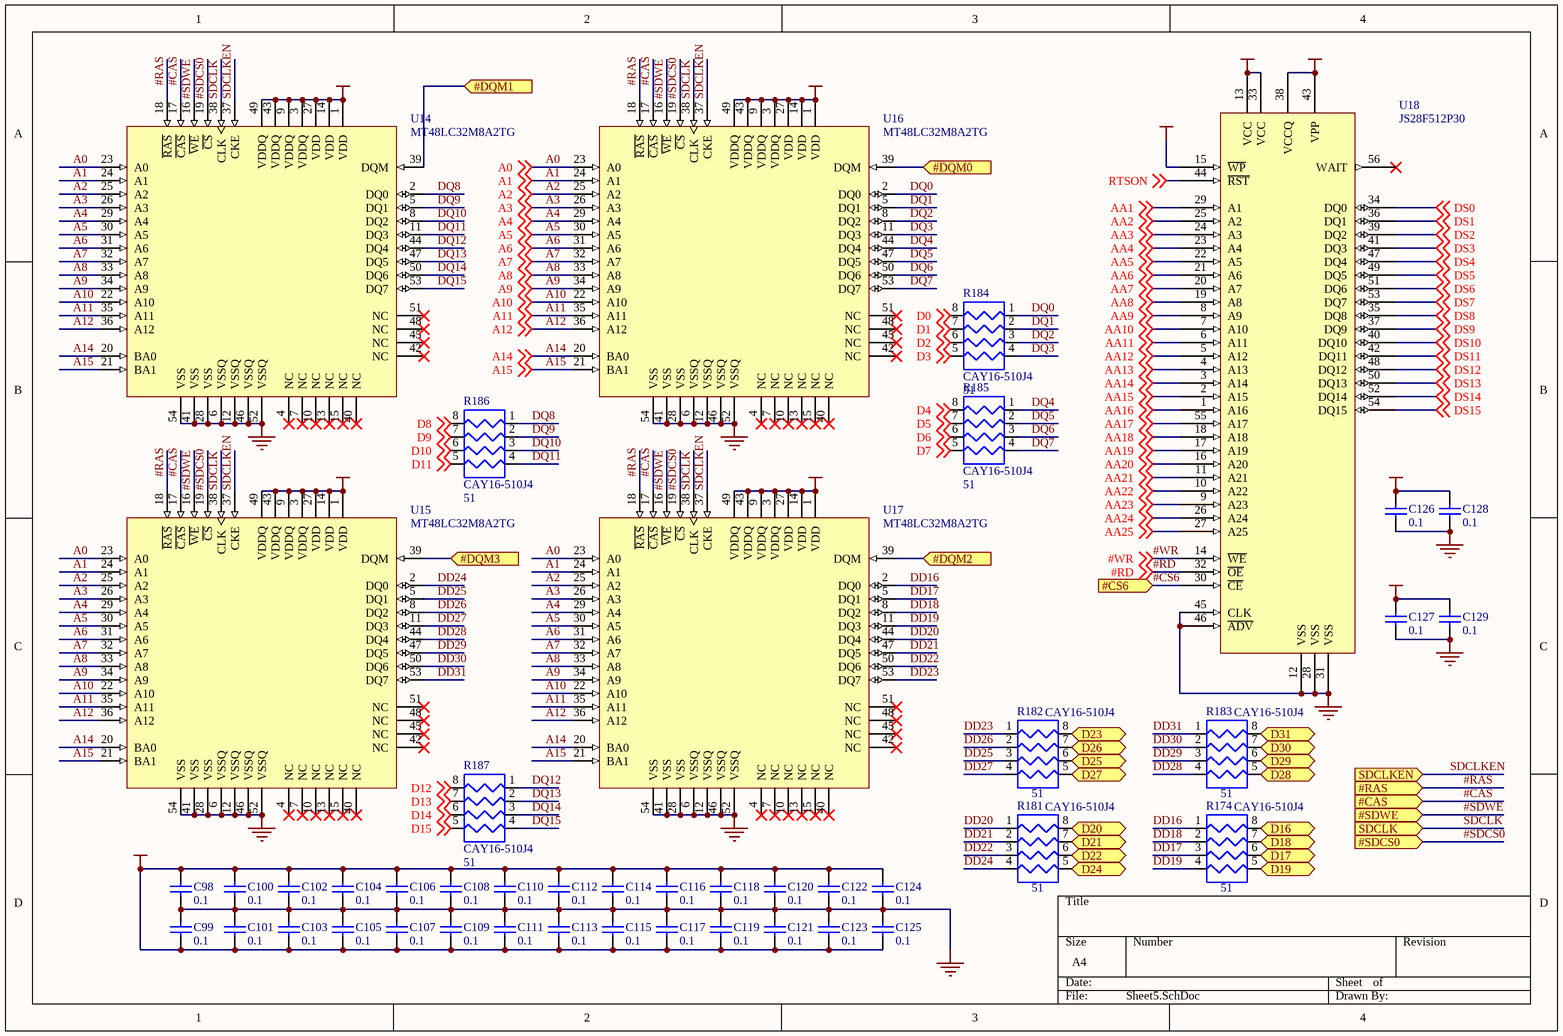
[diagram p4: Sheet5.SchDoc]

### Parts
(Parts that share a designator on the sheet are numbered #1, #2 ... from top to bottom, then left to right.)
C98  0.1  [0603]
C99  0.1  [0603]
C100  0.1  [0603]
C101  0.1  [0603]
C102  0.1  [0603]
C103  0.1  [0603]
C104  0.1  [0603]
C105  0.1  [0603]
C106  0.1  [0603]
C107  0.1  [0603]
C108  0.1  [0603]
C109  0.1  [0603]
C110  0.1  [0603]
C111  0.1  [0603]
C112  0.1  [0603]
C113  0.1  [0603]
C114  0.1  [0603]
C115  0.1  [0603]
C116  0.1  [0603]
C117  0.1  [0603]
C118  0.1  [0603]
C119  0.1  [0603]
C120  0.1  [0603]
C121  0.1  [0603]
C122  0.1  [0603]
C123  0.1  [0603]
C124  0.1  [0603]
C125  0.1  [0603]
C126#1  0.1  [0603]
C127#1  0.1  [0603]
C128#1  0.1  [0603]
C129#1  0.1  [0603]
R174  CAY16-510J4  value 51  [CAY16-J4]
R181  CAY16-510J4  value 51  [CAY16-J4]
R182  CAY16-510J4  value 51  [CAY16-J4]
R183  CAY16-510J4  value 51  [CAY16-J4]
R184  CAY16-510J4  value 51  [CAY16-J4]
R185  CAY16-510J4  value 51  [CAY16-J4]
R186  CAY16-510J4  value 51  [CAY16-J4]
R187  CAY16-510J4  value 51  [CAY16-J4]
U14  MT48LC32M8A2TG  [TSSOP2(0.44m)]
U15  MT48LC32M8A2TG  [TSSOP2(0.44m)]
U16  MT48LC32M8A2TG  [TSSOP2(0.44m)]
U17  MT48LC32M8A2TG  [TSSOP2(0.44m)]
U18  JS28F512P30  [TSOP56]

### Ports
#CAS (in), #CS6 (in), #DQM0 (in), #DQM1 (in), #DQM2 (in), #DQM3 (in), #RAS (in), #SDCS0 (in), #SDWE (in), D16 (bidir), D17 (bidir), D18 (bidir), D19 (bidir), D20 (bidir), D21 (bidir), D22 (bidir), D23 (bidir), D24 (bidir), D25 (bidir), D26 (bidir), D27 (bidir), D28 (bidir), D29 (bidir), D30 (bidir), D31 (bidir), SDCLK (in), SDCLKEN (in)

### Nets
GND: C98.1 C99.2 C100.1 C101.2 C102.1 C103.2 C104.1 C105.2 C106.1 C107.2 C108.1 C109.2 C110.1 C111.2 C112.1 C113.2 C114.1 C115.2 C116.1 C117.2 C118.1 C119.2 C120.1 C121.2 C122.1 C123.2 C124.1 C125.2 C126#1.1 C127#1.1 C128#1.1 C129#1.1 U14.6(VSSQ) U14.12(VSSQ) U14.28(VSS) U14.41(VSS) U14.46(VSSQ) U14.52(VSSQ) U14.54(VSS) U15.6(VSSQ) U15.12(VSSQ) U15.28(VSS) U15.41(VSS) U15.46(VSSQ) U15.52(VSSQ) U15.54(VSS) U16.6(VSSQ) U16.12(VSSQ) U16.28(VSS) U16.41(VSS) U16.46(VSSQ) U16.52(VSSQ) U16.54(VSS) U17.6(VSSQ) U17.12(VSSQ) U17.28(VSS) U17.41(VSS) U17.46(VSSQ) U17.52(VSSQ) U17.54(VSS) U18.12(VSS) U18.28(VSS) U18.31(VSS) U18.45(CLK) U18.46(~{ADV})
VCCCORE: C127#1.2 C129#1.2 U18.13(VCC) U18.33(VCC)
VCCIO: C98.2 C99.1 C100.2 C101.1 C102.2 C103.1 C104.2 C105.1 C106.2 C107.1 C108.2 C109.1 C110.2 C111.1 C112.2 C113.1 C114.2 C115.1 C116.2 C117.1 C118.2 C119.1 C120.2 C121.1 C122.2 C123.1 C124.2 C125.1 C126#1.2 C128#1.2 U14.1(VDD) U14.3(VDDQ) U14.9(VDDQ) U14.14(VDD) U14.27(VDD) U14.43(VDDQ) U14.49(VDDQ) U15.1(VDD) U15.3(VDDQ) U15.9(VDDQ) U15.14(VDD) U15.27(VDD) U15.43(VDDQ) U15.49(VDDQ) U16.1(VDD) U16.3(VDDQ) U16.9(VDDQ) U16.14(VDD) U16.27(VDD) U16.43(VDDQ) U16.49(VDDQ) U17.1(VDD) U17.3(VDDQ) U17.9(VDDQ) U17.14(VDD) U17.27(VDD) U17.43(VDDQ) U17.49(VDDQ) U18.15(~{WP}) U18.38(VCCQ) U18.43(VPP)
#CAS: U14.17(~{CAS}) U15.17(~{CAS}) U16.17(~{CAS}) U17.17(~{CAS}) ; port #CAS
#CS6: U18.30(~{CE}) ; port #CS6
#DQM0: U16.39(DQM) ; port #DQM0
#DQM1: U14.39(DQM) ; port #DQM1
#DQM2: U17.39(DQM) ; port #DQM2
#DQM3: U15.39(DQM) ; port #DQM3
#RAS: U14.18(~{RAS}) U15.18(~{RAS}) U16.18(~{RAS}) U17.18(~{RAS}) ; port #RAS
#RD: U18.32(~{OE}) ; off-sheet #RD
#SDCS0: U14.19(~{CS}) U15.19(~{CS}) U16.19(~{CS}) U17.19(~{CS}) ; port #SDCS0
#SDWE: U14.16(~{WE}) U15.16(~{WE}) U16.16(~{WE}) U17.16(~{WE}) ; port #SDWE
#WR: U18.14(~{WE}) ; off-sheet #WR
A0: U14.23(A0) U15.23(A0) U16.23(A0) U17.23(A0) ; off-sheet A0
A1: U14.24(A1) U15.24(A1) U16.24(A1) U17.24(A1) ; off-sheet A1
A2: U14.25(A2) U15.25(A2) U16.25(A2) U17.25(A2) ; off-sheet A2
A3: U14.26(A3) U15.26(A3) U16.26(A3) U17.26(A3) ; off-sheet A3
A4: U14.29(A4) U15.29(A4) U16.29(A4) U17.29(A4) ; off-sheet A4
A5: U14.30(A5) U15.30(A5) U16.30(A5) U17.30(A5) ; off-sheet A5
A6: U14.31(A6) U15.31(A6) U16.31(A6) U17.31(A6) ; off-sheet A6
A7: U14.32(A7) U15.32(A7) U16.32(A7) U17.32(A7) ; off-sheet A7
A8: U14.33(A8) U15.33(A8) U16.33(A8) U17.33(A8) ; off-sheet A8
A9: U14.34(A9) U15.34(A9) U16.34(A9) U17.34(A9) ; off-sheet A9
A10: U14.22(A10) U15.22(A10) U16.22(A10) U17.22(A10) ; off-sheet A10
A11: U14.35(A11) U15.35(A11) U16.35(A11) U17.35(A11) ; off-sheet A11
A12: U14.36(A12) U15.36(A12) U16.36(A12) U17.36(A12) ; off-sheet A12
A14: U14.20(BA0) U15.20(BA0) U16.20(BA0) U17.20(BA0) ; off-sheet A14
A15: U14.21(BA1) U15.21(BA1) U16.21(BA1) U17.21(BA1) ; off-sheet A15
AA1: U18.29(A1) ; off-sheet AA1
AA2: U18.25(A2) ; off-sheet AA2
AA3: U18.24(A3) ; off-sheet AA3
AA4: U18.23(A4) ; off-sheet AA4
AA5: U18.22(A5) ; off-sheet AA5
AA6: U18.21(A6) ; off-sheet AA6
AA7: U18.20(A7) ; off-sheet AA7
AA8: U18.19(A8) ; off-sheet AA8
AA9: U18.8(A9) ; off-sheet AA9
AA10: U18.7(A10) ; off-sheet AA10
AA11: U18.6(A11) ; off-sheet AA11
AA12: U18.5(A12) ; off-sheet AA12
AA13: U18.4(A13) ; off-sheet AA13
AA14: U18.3(A14) ; off-sheet AA14
AA15: U18.2(A15) ; off-sheet AA15
AA16: U18.1(A16) ; off-sheet AA16
AA17: U18.55(A17) ; off-sheet AA17
AA18: U18.18(A18) ; off-sheet AA18
AA19: U18.17(A19) ; off-sheet AA19
AA20: U18.16(A20) ; off-sheet AA20
AA21: U18.11(A21) ; off-sheet AA21
AA22: U18.10(A22) ; off-sheet AA22
AA23: U18.9(A23) ; off-sheet AA23
AA24: U18.26(A24) ; off-sheet AA24
AA25: U18.27(A25) ; off-sheet AA25
D0: R184.8 ; off-sheet D0
D1: R184.7 ; off-sheet D1
D2: R184.6 ; off-sheet D2
D3: R184.5 ; off-sheet D3
D4: R185.8 ; off-sheet D4
D5: R185.7 ; off-sheet D5
D6: R185.6 ; off-sheet D6
D7: R185.5 ; off-sheet D7
D8: R186.8 ; off-sheet D8
D9: R186.7 ; off-sheet D9
D10: R186.6 ; off-sheet D10
D11: R186.5 ; off-sheet D11
D12: R187.8 ; off-sheet D12
D13: R187.7 ; off-sheet D13
D14: R187.6 ; off-sheet D14
D15: R187.5 ; off-sheet D15
D16: R174.8 ; port D16
D17: R174.6 ; port D17
D18: R174.7 ; port D18
D19: R174.5 ; port D19
D20: R181.8 ; port D20
D21: R181.7 ; port D21
D22: R181.6 ; port D22
D23: R182.8 ; port D23
D24: R181.5 ; port D24
D25: R182.6 ; port D25
D26: R182.7 ; port D26
D27: R182.5 ; port D27
D28: R183.5 ; port D28
D29: R183.6 ; port D29
D30: R183.7 ; port D30
D31: R183.8 ; port D31
DD16: R174.1 U17.2(DQ0)
DD17: R174.3 U17.5(DQ1)
DD18: R174.2 U17.8(DQ2)
DD19: R174.4 U17.11(DQ3)
DD20: R181.1 U17.44(DQ4)
DD21: R181.2 U17.47(DQ5)
DD22: R181.3 U17.50(DQ6)
DD23: R182.1 U17.53(DQ7)
DD24: R181.4 U15.2(DQ0)
DD25: R182.3 U15.5(DQ1)
DD26: R182.2 U15.8(DQ2)
DD27: R182.4 U15.11(DQ3)
DD28: R183.4 U15.44(DQ4)
DD29: R183.3 U15.47(DQ5)
DD30: R183.2 U15.50(DQ6)
DD31: R183.1 U15.53(DQ7)
DQ0: R184.1 U16.2(DQ0)
DQ1: R184.2 U16.5(DQ1)
DQ2: R184.3 U16.8(DQ2)
DQ3: R184.4 U16.11(DQ3)
DQ4: R185.1 U16.44(DQ4)
DQ5: R185.2 U16.47(DQ5)
DQ6: R185.3 U16.50(DQ6)
DQ7: R185.4 U16.53(DQ7)
DQ8: R186.1 U14.2(DQ0)
DQ9: R186.2 U14.5(DQ1)
DQ10: R186.3 U14.8(DQ2)
DQ11: R186.4 U14.11(DQ3)
DQ12: R187.1 U14.44(DQ4)
DQ13: R187.2 U14.47(DQ5)
DQ14: R187.3 U14.50(DQ6)
DQ15: R187.4 U14.53(DQ7)
DS0: U18.34(DQ0) ; off-sheet DS0
DS1: U18.36(DQ1) ; off-sheet DS1
DS2: U18.39(DQ2) ; off-sheet DS2
DS3: U18.41(DQ3) ; off-sheet DS3
DS4: U18.47(DQ4) ; off-sheet DS4
DS5: U18.49(DQ5) ; off-sheet DS5
DS6: U18.51(DQ6) ; off-sheet DS6
DS7: U18.53(DQ7) ; off-sheet DS7
DS8: U18.35(DQ8) ; off-sheet DS8
DS9: U18.37(DQ9) ; off-sheet DS9
DS10: U18.40(DQ10) ; off-sheet DS10
DS11: U18.42(DQ11) ; off-sheet DS11
DS12: U18.48(DQ12) ; off-sheet DS12
DS13: U18.50(DQ13) ; off-sheet DS13
DS14: U18.52(DQ14) ; off-sheet DS14
DS15: U18.54(DQ15) ; off-sheet DS15
RTSON: U18.44(~{RST}) ; off-sheet RTSON
SDCLK: U14.38(CLK) U15.38(CLK) U16.38(CLK) U17.38(CLK) ; port SDCLK
SDCLKEN: U14.37(CKE) U15.37(CKE) U16.37(CKE) U17.37(CKE) ; port SDCLKEN

Not connected (* = marked no-connect by the designer): U14 4(NC)* 7(NC)* 10(NC)* 13(NC)* 15(NC)* 40(NC)* 42(NC)* 45(NC)* 48(NC)* 51(NC)*; U15 4(NC)* 7(NC)* 10(NC)* 13(NC)* 15(NC)* 40(NC)* 42(NC)* 45(NC)* 48(NC)* 51(NC)*; U16 4(NC)* 7(NC)* 10(NC)* 13(NC)* 15(NC)* 40(NC)* 42(NC)* 45(NC)* 48(NC)* 51(NC)*; U17 4(NC)* 7(NC)* 10(NC)* 13(NC)* 15(NC)* 40(NC)* 42(NC)* 45(NC)* 48(NC)* 51(NC)*; U18 56(WAIT)*

### Library data of the parts
C98-C125 C126#1 C127#1 C128#1 C129#1 = C0603: as C1 on sheet Sheet1; Published: 17-Jul-2002; LatestRevisionDate: 19-Mar-2004; LatestRevisionNote: Silkscreen size reduced.; DatasheetDocument: Mar-2001; PackageDocument: Mar-2001; PackageReference: 0603; Publisher: Altium Limited; Code_JEITA: 0603; Code_IPC: 1608 [0603]; ComponentLink1Description: Manufacturer Link; ComponentLink1URL: http://www.kemet.com/; ComponentLink2Description: Datasheet; ComponentLink2URL: http://www.kemet.com/kemet/web/homepage/kechome.nsf/vapubfilesname/F3102TA.pdf/$file/F3102TA.pdf; Value: 0.1
R174 R181-R187 = CAY16-J4: Chip Resistor Arrays
U14-U17 = MT48LC32M8A2TG: 32 Meg x 8 Synchronous DRAM; Package Information: Latest Revision: revE, Mar-2002; Code - JEDEC: MS-024-FA; Published: 30-Oct-2002; Datasheet: Latest Revision: Mar-2002, Rev E; Package Reference: TSOP-54; Publisher: Altium Limited
U18 = JS28F512P30: Intel StrataFLASH

## Sheet Sheet6.SchDoc
size A4
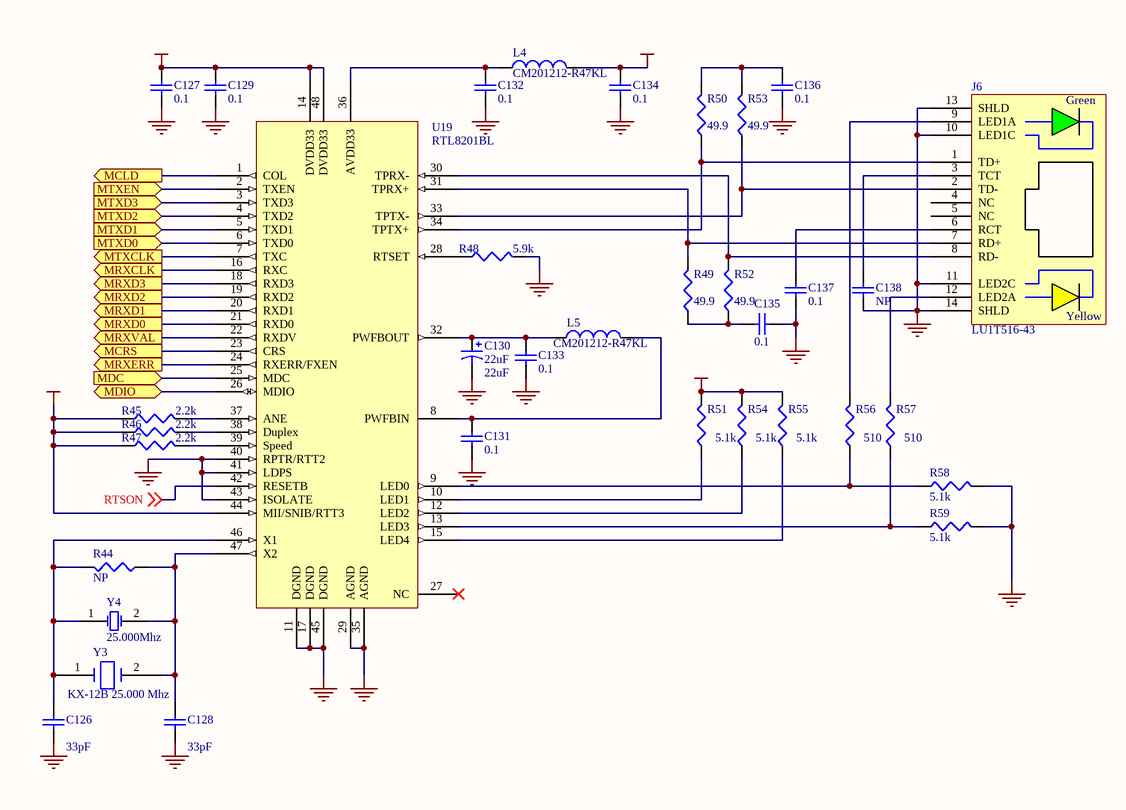
[diagram p5: Sheet6.SchDoc]

### Parts
(Parts that share a designator on the sheet are numbered #1, #2 ... from top to bottom, then left to right.)
C126#2  33pF  [0603]
C127#2  0.1  [0603]
C128#2  33pF  [0603]
C129#2  0.1  [0603]
C130  22uF  [B]
C131  0.1  [0603]
C132  0.1  [0603]
C133  0.1  [0603]
C134  0.1  [0603]
C135  0.1  [0603]
C136  0.1  [0603]
C137  0.1  [0603]
C138  NP  [0603]
J6  LU1T516-43  [LU1T516-43]
L4  CM201212-R47KL  [INDC2012-0805]
L5  CM201212-R47KL  [INDC2012-0805]
R44#2  NP  [CR1608-0603]
R45#2  2.2k  [CR1608-0603]
R46#2  2.2k  [CR1608-0603]
R47  2.2k  [CR1608-0603]
R48  5.9k  [CR1608-0603]
R49  49.9  [CR1608-0603]
R50  49.9  [CR1608-0603]
R51  5.1k  [CR1608-0603]
R52  49.9  [CR1608-0603]
R53  49.9  [CR1608-0603]
R54  5.1k  [CR1608-0603]
R55  5.1k  [CR1608-0603]
R56  510  [CR1608-0603]
R57  510  [CR1608-0603]
R58  5.1k  [CR1608-0603]
R59  5.1k  [CR1608-0603]
U19  RTL8201BL  [F-QFP7x7-G48/X.3N]
Y3  KX-12B 25.000 Mhz  [KX-12B]
Y4  25.000Mhz  [HC-49U]

### Ports
MCLD (out), MCRS (out), MDC (in), MDIO (bidir), MRXCLK (out), MRXD0 (out), MRXD1 (out), MRXD2 (out), MRXD3 (out), MRXERR (out), MRXVAL (out), MTXCLK (out), MTXD0 (in), MTXD1 (in), MTXD2 (in), MTXD3 (in), MTXEN (in)

### Nets
GND: C126#2.1 C127#2.1 C128#2.1 C129#2.1 C130.2 C131.1 C132.1 C133.1 C134.1 C135.1 C136.1 C137.1 C138.1 J6.10(LED1C) J6.11(LED2C) J6.13(SHLD) J6.14(SHLD) R48.2 R58.2 R59.2 U19.11(DGND) U19.17(DGND) U19.29(AGND) U19.35(AGND) U19.40(RPTR/RTT2) U19.41(LDPS) U19.43(ISOLATE) U19.45(DGND)
VCCIO: C127#2.2 C129#2.2 C134.2 L4.2 R45#2.1 R46#2.1 R47.1 R51.2 R54.2 R55.2 U19.14(DVDD33) U19.44(MII/SNIB/RTT3) U19.48(DVDD33)
MCLD: U19.1(COL) ; port MCLD
MCRS: U19.23(CRS) ; port MCRS
MDC: U19.25(MDC) ; port MDC
MDIO: U19.26(MDIO) ; port MDIO
MRXCLK: U19.16(RXC) ; port MRXCLK
MRXD0: U19.21(RXD0) ; port MRXD0
MRXD1: U19.20(RXD1) ; port MRXD1
MRXD2: U19.19(RXD2) ; port MRXD2
MRXD3: U19.18(RXD3) ; port MRXD3
MRXERR: U19.24(RXERR/FXEN) ; port MRXERR
MRXVAL: U19.22(RXDV) ; port MRXVAL
MTXCLK: U19.7(TXC) ; port MTXCLK
MTXD0: U19.6(TXD0) ; port MTXD0
MTXD1: U19.5(TXD1) ; port MTXD1
MTXD2: U19.4(TXD2) ; port MTXD2
MTXD3: U19.3(TXD3) ; port MTXD3
MTXEN: U19.2(TXEN) ; port MTXEN
RTSON: U19.42(RESETB) ; off-sheet RTSON
NetC126#2_2: C126#2.2 R44#2.2 U19.46(X1) Y3.1 Y4.1(OSC1)
NetC128#2_2: C128#2.2 R44#2.1 U19.47(X2) Y3.2 Y4.2(OSC2)
NetC130_1: C130.1 C133.2 L5.1 U19.32(PWFBOUT)
NetC131_2: C131.2 L5.2 U19.8(PWFBIN)
NetC132_2: C132.2 L4.1 U19.36(AVDD33)
NetC135_2: C135.2 R49.1 R52.1
NetC136_2: C136.2 R50.2 R53.2
NetC137_2: C137.2 J6.6(RCT)
NetC138_2: C138.2 J6.3(TCT)
NetJ6_1: J6.1(TD+) R50.1 U19.34(TPTX+)
NetJ6_2: J6.2(TD-) R53.1 U19.33(TPTX-)
NetJ6_7: J6.7(RD+) R49.2 U19.31(TPRX+)
NetJ6_8: J6.8(RD-) R52.2 U19.30(TPRX-)
NetJ6_9: J6.9(LED1A) R56.2
NetJ6_12: J6.12(LED2A) R57.2
NetR45#2_2: R45#2.2 U19.37(ANE)
NetR46#2_2: R46#2.2 U19.38(Duplex)
NetR47_2: R47.2 U19.39(Speed)
NetR48_1: R48.1 U19.28(RTSET)
NetR51_1: R51.1 U19.10(LED1)
NetR54_1: R54.1 U19.12(LED2)
NetR55_1: R55.1 U19.15(LED4)
NetR56_1: R56.1 R58.1 U19.9(LED0)
NetR57_1: R57.1 R59.1 U19.13(LED3)

Not connected (* = marked no-connect by the designer): J6 4(NC) 5(NC); U19 27(NC)*

### Notes on the sheet
- (in symbol LU1T516-43) Green; Yellow

### Library data of the parts
C126#2 C127#2 C128#2 C129#2 C131-C137 = C0603: as C1 on sheet Sheet1; Published: 17-Jul-2002; LatestRevisionDate: 19-Mar-2004; LatestRevisionNote: Silkscreen size reduced.; DatasheetDocument: Mar-2001; PackageDocument: Mar-2001; PackageReference: 0603; Publisher: Altium Limited; Code_JEITA: 0603; Code_IPC: 1608 [0603]; ComponentLink1Description: Manufacturer Link; ComponentLink1URL: http://www.kemet.com/; ComponentLink2Description: Datasheet; ComponentLink2URL: http://www.kemet.com/kemet/web/homepage/kechome.nsf/vapubfilesname/F3102TA.pdf/$file/F3102TA.pdf
  C126#2 C128#2: Value: 33pF
  C127#2 C129#2 C131-C137: Value: 0.1
C130 = T491B: Solid Tantalum Chip Capacitor, Standard T491 Series - Industrial Grade; Published: 17-Jul-2002; LatestRevisionDate: 19-Mar-2004; LatestRevisionNote: Silkscreen dimensions re-sized.; DatasheetDocument: Mar-2001; PackageDocument: Mar-2001; PackageReference: B; Publisher: Altium Limited; Code_JEITA: 3528-21; ComponentLink1Description: Manufacturer Link; ComponentLink1URL: http://www.kemet.com/; ComponentLink2Description: Datasheet; ComponentLink2URL: http://www.kemet.com/kemet/web/homepage/kechome.nsf/vapubfilesname/F3102TA.pdf/$file/F3102TA.pdf; Value: 22uF
C138 = C0603: as C5 on sheet Sheet1; Published: 17-Jul-2002; LatestRevisionDate: 19-Mar-2004; LatestRevisionNote: Silkscreen size reduced.; DatasheetDocument: Mar-2001; PackageDocument: Mar-2001; PackageReference: 0603; Publisher: Altium Limited; Code_JEITA: 0603; Code_IPC: 1608 [0603]; ComponentLink1Description: Manufacturer Link; ComponentLink1URL: http://www.kemet.com/; ComponentLink2Description: Datasheet; ComponentLink2URL: http://www.kemet.com/kemet/web/homepage/kechome.nsf/vapubfilesname/F3102TA.pdf/$file/F3102TA.pdf
J6 = LU1T516-43: Single RJ45 connector with integrated 10/100 BASE-TX magnetics and leds
L4 L5 = Inductor: Published: 8-Jun-2000; Revision: July-2002: Re-released for DXP Platform.; Publisher: Altium Limited; Value: CM201212-R47KL
R44#2 R45#2 R46#2 R47-R59 = Res3: Resistor; Published: 8-Jun-2000; Revision: July-2002: Re-released for DXP Platform.; Publisher: Altium Limited
  R44#2: Value: NP
  R45#2 R46#2 R47: Value: 2.2k
  R48: Value: 5.9k
  R49 R50 R52 R53: Value: 49.9
  R51 R54 R55 R58 R59: Value: 5.1k
  R56 R57: Value: 510
U19 = RTL8201BL: MII PHY
Y3 = QRZ_KX_12B: QUARTZ CRYSTAL
Y4 = ECS-10-13-1: Crystal Oscillator; Published: 17-Jul-2002; DatasheetDocument: 18-Apr-2000; PackageReference: HC-49U; Publisher: Altium Limited; ComponentLink1Description: Manufacturer Link; ComponentLink1URL: http://www.ecsxtal.com/; ComponentLink2Description: Datasheet; ComponentLink2URL: http://www.ecsxtal.com/pdf2/HC49U.PDF